# EAGLE design ALM_DEV2_i2 (EAGLE 5.07)

## Sheet 1 of 6
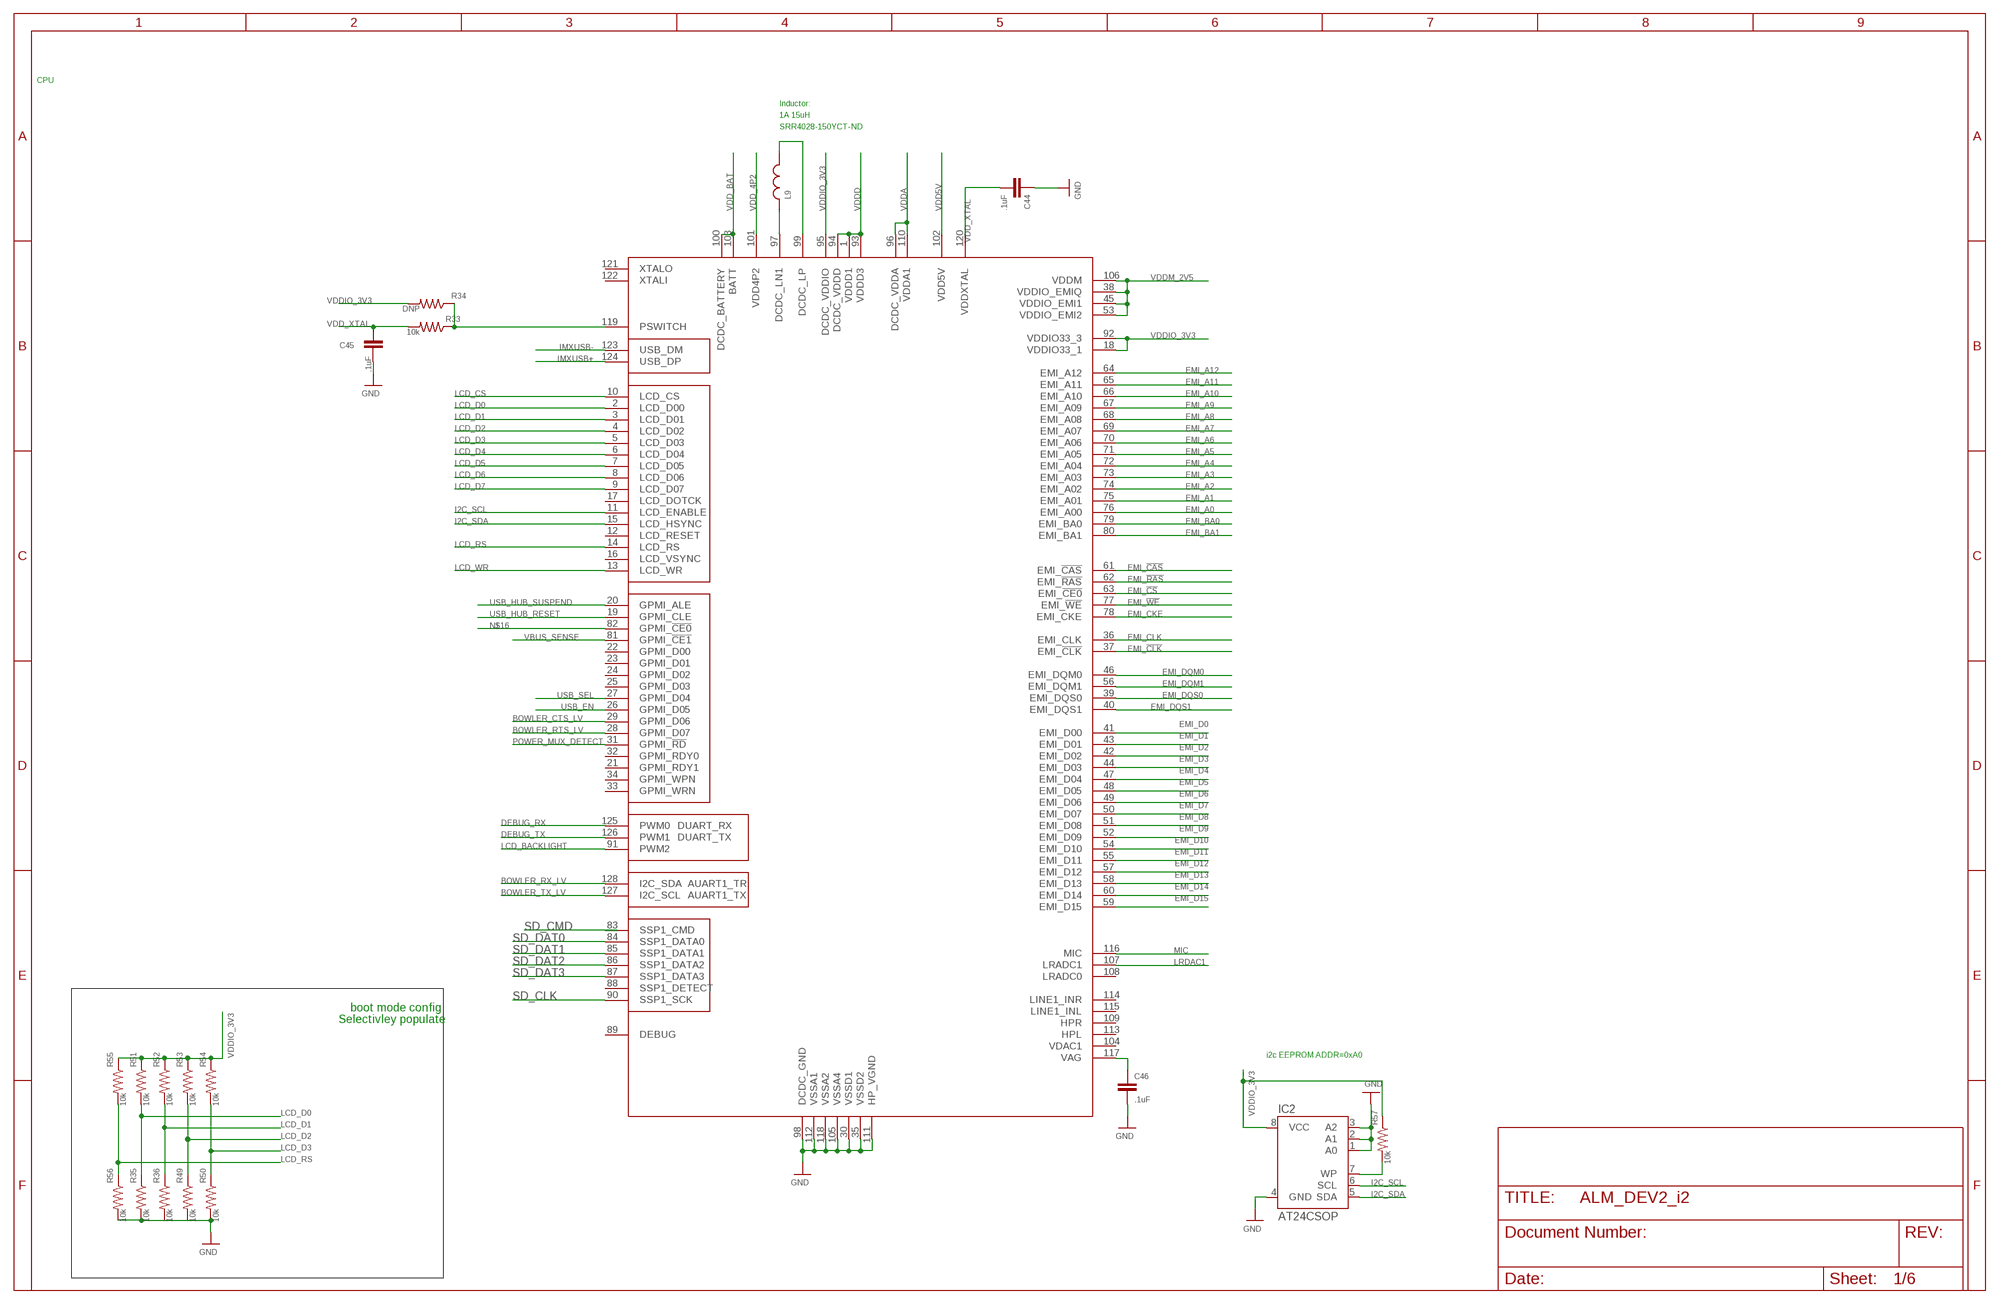
[diagram p0: schematic, sheet 1]

### Parts
C44  .1uF  C-EUC0402  [C0402]
C45  .1uF  C-EUC0402  [C0402]
C46  .1uF  C-EUC0402  [C0402]
IC2  AT24CSOP  [TSSOP8]
L9  INDUCTOR  [SRR4028]
R33  10k  R-US_R0603  [R0603]
R34  DNP  R-US_R0603  [R0603]
R35  10k  R-US_R0603  [R0603]
R36  10k  R-US_R0603  [R0603]
R49  10k  R-US_R0603  [R0603]
R50  10k  R-US_R0603  [R0603]
R51  10k  R-US_R0603  [R0603]
R52  10k  R-US_R0603  [R0603]
R53  10k  R-US_R0603  [R0603]
R54  10k  R-US_R0603  [R0603]
R55  10k  R-US_R0603  [R0603]
R56  10k  R-US_R0603  [R0603]
R57  10k  R-US_R0603  [R0603]
U$13  IMX233TQFP  [14MM_128TQFP_E0.40]

### Nets
BOWLER_CTS_LV: U$13.29(GPMI_D06) ; also sheet 5
BOWLER_RTS_LV: U$13.28(GPMI_D07) ; also sheet 5
BOWLER_RX_LV: U$13.128(I2C_SDA) ; also sheet 5
BOWLER_TX_LV: U$13.127(I2C_SCL) ; also sheet 5
DCDC_LIN1: L9.1 U$13.97(DCDC_LN1)
DCDC_LP1: L9.2 U$13.99(DCDC_LP)
DEBUG_RX: U$13.125(PWM0)
DEBUG_TX: U$13.126(PWM1)
EMI_!CAS: U$13.61(EMI_!CAS) ; also sheet 4
EMI_!CLK: U$13.37(EMI_!CLK) ; also sheet 4
EMI_!CS: U$13.63(EMI_!CE0) ; also sheet 4
EMI_!RAS: U$13.62(EMI_!RAS) ; also sheet 4
EMI_!WE: U$13.77(EMI_!WE) ; also sheet 4
EMI_A0: U$13.76(EMI_A00) ; also sheet 4
EMI_A1: U$13.75(EMI_A01) ; also sheet 4
EMI_A2: U$13.74(EMI_A02) ; also sheet 4
EMI_A3: U$13.73(EMI_A03) ; also sheet 4
EMI_A4: U$13.72(EMI_A04) ; also sheet 4
EMI_A5: U$13.71(EMI_A05) ; also sheet 4
EMI_A6: U$13.70(EMI_A06) ; also sheet 4
EMI_A7: U$13.69(EMI_A07) ; also sheet 4
EMI_A8: U$13.68(EMI_A08) ; also sheet 4
EMI_A9: U$13.67(EMI_A09) ; also sheet 4
EMI_A10: U$13.66(EMI_A10) ; also sheet 4
EMI_A11: U$13.65(EMI_A11) ; also sheet 4
EMI_A12: U$13.64(EMI_A12) ; also sheet 4
EMI_BA0: U$13.79(EMI_BA0) ; also sheet 4
EMI_BA1: U$13.80(EMI_BA1) ; also sheet 4
EMI_CKE: U$13.78(EMI_CKE) ; also sheet 4
EMI_CLK: U$13.36(EMI_CLK) ; also sheet 4
EMI_D0: U$13.41(EMI_D00) ; also sheet 4
EMI_D1: U$13.43(EMI_D01) ; also sheet 4
EMI_D2: U$13.42(EMI_D02) ; also sheet 4
EMI_D3: U$13.44(EMI_D03) ; also sheet 4
EMI_D4: U$13.47(EMI_D04) ; also sheet 4
EMI_D5: U$13.48(EMI_D05) ; also sheet 4
EMI_D6: U$13.49(EMI_D06) ; also sheet 4
EMI_D7: U$13.50(EMI_D07) ; also sheet 4
EMI_D8: U$13.51(EMI_D08) ; also sheet 4
EMI_D9: U$13.52(EMI_D09) ; also sheet 4
EMI_D10: U$13.54(EMI_D10) ; also sheet 4
EMI_D11: U$13.55(EMI_D11) ; also sheet 4
EMI_D12: U$13.57(EMI_D12) ; also sheet 4
EMI_D13: U$13.58(EMI_D13) ; also sheet 4
EMI_D14: U$13.60(EMI_D14) ; also sheet 4
EMI_D15: U$13.59(EMI_D15) ; also sheet 4
EMI_DQM0: U$13.46(EMI_DQM0) ; also sheet 4
EMI_DQM1: U$13.56(EMI_DQM1) ; also sheet 4
EMI_DQS0: U$13.39(EMI_DQS0) ; also sheet 4
EMI_DQS1: U$13.40(EMI_DQS1) ; also sheet 4
GND: C44.1 C45.2 C46.2 IC2.1(A0) IC2.2(A1) IC2.3(A2) IC2.4(GND) R35.2 R50.2 R56.2 U$13.30(VSSD1) U$13.35(VSSD2) U$13.98(DCDC_GND) U$13.105(VSSA4) U$13.111(HP_VGND) U$13.112(VSSA1) U$13.118(VSSA2) ; also sheet 2,3,4,5
I2C_SCL: IC2.6(SCL) U$13.11(LCD_ENABLE)
I2C_SDA: IC2.5(SDA) U$13.15(LCD_HSYNC)
IMXUSB+: U$13.124(USB_DP) ; also sheet 2
IMXUSB-: U$13.123(USB_DM) ; also sheet 2
LCD_BACKLIGHT: U$13.91(PWM2) ; also sheet 5
LCD_CS: U$13.10(LCD_CS) ; also sheet 5
LCD_D0: R35.1 R51.2 U$13.2(LCD_D00) ; also sheet 5
LCD_D1: R36.1 R52.2 U$13.3(LCD_D01) ; also sheet 5
LCD_D2: R49.1 R53.2 U$13.4(LCD_D02) ; also sheet 5
LCD_D3: R50.1 R54.2 U$13.5(LCD_D03) ; also sheet 5
LCD_D4: U$13.6(LCD_D04) ; also sheet 5
LCD_D5: U$13.7(LCD_D05) ; also sheet 5
LCD_D6: U$13.8(LCD_D06) ; also sheet 5
LCD_D7: U$13.9(LCD_D07) ; also sheet 5
LCD_RS: R55.2 R56.1 U$13.14(LCD_RS) ; also sheet 5
LCD_WR: U$13.13(LCD_WR) ; also sheet 5
LRDAC1: U$13.107(LRADC1) ; also sheet 5
MIC: U$13.116(MIC) ; also sheet 5
N$16: U$13.82(GPMI_!CE0)
N$26: R33.1 R34.1 U$13.119(PSWITCH)
N$27: IC2.7(WP) R57.2
N$28: C46.1 U$13.117(VAG)
POWER_MUX_DETECT: U$13.31(GPMI_!RD)
USB_EN: U$13.26(GPMI_D05) ; also sheet 2
USB_HUB_RESET: U$13.19(GPMI_CLE) ; also sheet 2
USB_HUB_SUSPEND: U$13.20(GPMI_ALE) ; also sheet 2
USB_SEL: U$13.27(GPMI_D04) ; also sheet 2
VBUS_SENSE: U$13.81(GPMI_!CE1) ; also sheet 2
VDD5V: U$13.102(VDD5V) ; also sheet 3
VDD_4P2: U$13.101(VDD4P2) ; also sheet 3
VDD_BAT: U$13.100(DCDC_BATTERY) U$13.103(BATT)
VDD_XTAL: C44.2 C45.1 R33.2 U$13.120(VDDXTAL)
VDDA: U$13.96(DCDC_VDDA) U$13.110(VDDA1) ; also sheet 3
VDDD: U$13.1(VDDD1) U$13.93(VDDD3) U$13.94(DCDC_VDDD) ; also sheet 3
VDDIO_3V3: IC2.8(VCC) R34.2 R51.1 R52.1 R53.1 R54.1 R55.1 R57.1 U$13.18(VDDIO33_1) U$13.92(VDDIO33_3) U$13.95(DCDC_VDDIO) ; also sheet 2,3,5
VDDM_2V5: U$13.38(VDDIO_EMIQ) U$13.45(VDDIO_EMI1) U$13.53(VDDIO_EMI2) U$13.106(VDDM) ; also sheet 3,4
Unconnected: R36.2 R49.2 U$13.12(LCD_RESET) U$13.16(LCD_VSYNC) U$13.17(LCD_DOTCK) U$13.21(GPMI_RDY1) U$13.22(GPMI_D00) U$13.23(GPMI_D01) U$13.24(GPMI_D02) U$13.25(GPMI_D03) U$13.32(GPMI_RDY0) U$13.33(GPMI_WRN) U$13.34(GPMI_WPN) U$13.83(SSP1_CMD) U$13.84(SSP1_DATA0) U$13.85(SSP1_DATA1) U$13.86(SSP1_DATA2) U$13.87(SSP1_DATA3) U$13.88(SSP1_DETECT) U$13.89(DEBUG) U$13.90(SSP1_SCK) U$13.104(VDAC1) U$13.108(LRADC0) U$13.109(HPR) U$13.113(HPL) U$13.114(LINE1_INR) U$13.115(LINE1_INL) U$13.121(XTALO) U$13.122(XTALI)

### Notes on the sheet
- CPU
- Inductor:
- 1A 15uH
- SRR4028-150YCT-ND
- boot mode config
- Selectivley populate
- i2c EEPROM ADDR=0xA0

## Sheet 2 of 6
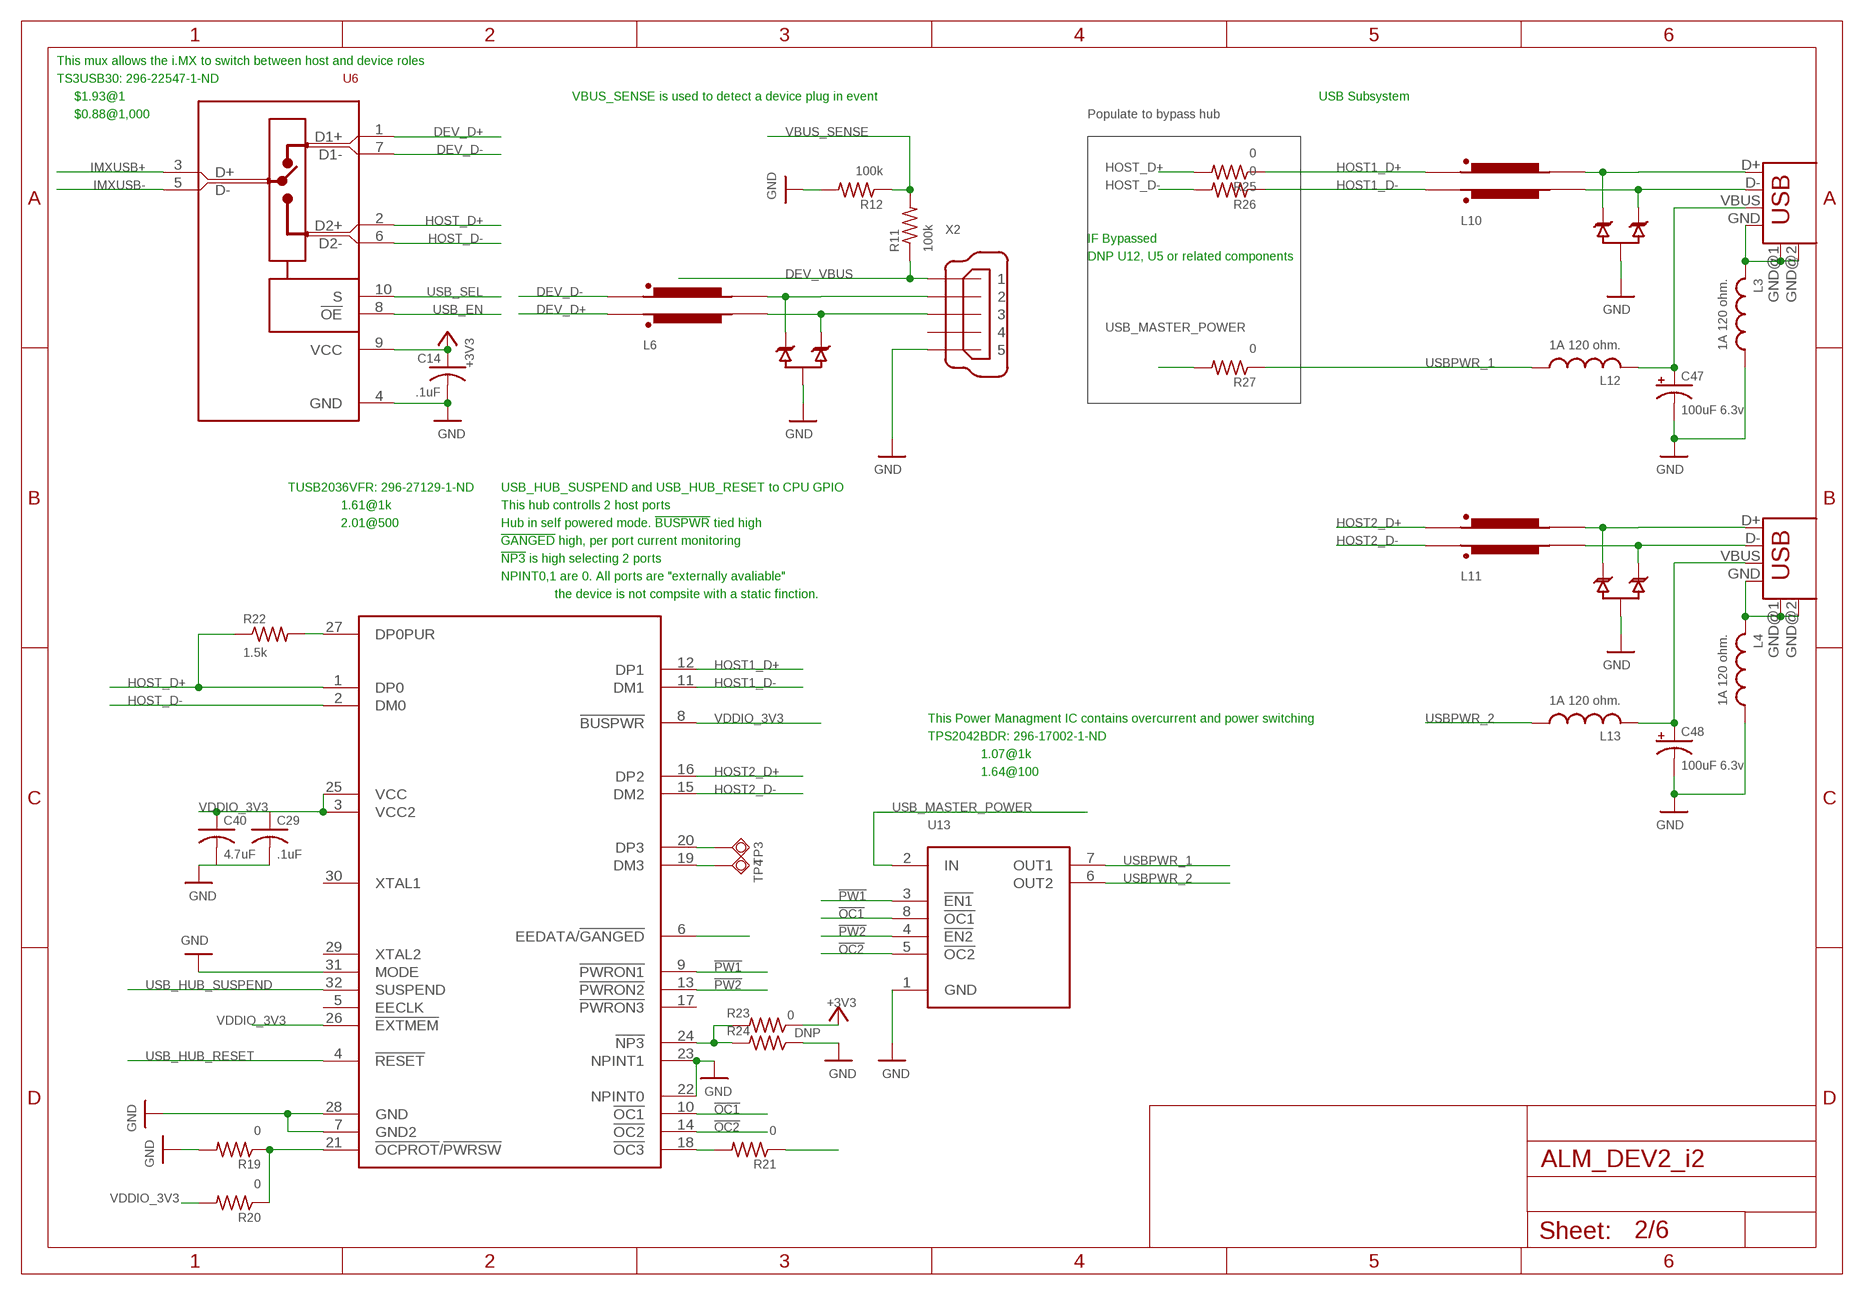
[diagram p1: schematic, sheet 2]

### Parts
C14  .1uF  C-USC0603  [C0603]
C29  .1uF  C-USC0603  [C0603]
C40  4.7uF  C-USC0603  [C0603]
C47  100uF 6.3v  CPOL-USE1.8-4  [E1,8-4]
C48  100uF 6.3v  CPOL-USE1.8-4  [E1,8-4]
L3  1A 120 ohm.  L-USL2825P  [L2825P]
L4  1A 120 ohm.  L-USL2825P  [L2825P]
L6  FERITE_S0805  [SPLIT_0805]
L10  FERITE_S0805  [SPLIT_0805]
L11  FERITE_S0805  [SPLIT_0805]
L12  1A 120 ohm.  L-USL2825P  [L2825P]
L13  1A 120 ohm.  L-USL2825P  [L2825P]
R11  100k  R-US_R0603  [R0603]
R12  100k  R-US_R0603  [R0603]
R19  0  R-US_R0603  [R0603]
R20  0  R-US_R0603  [R0603]
R21  0  R-US_R0603  [R0603]
R22  1.5k  R-US_R0603  [R0603]
R23  0  R-US_R0603  [R0603]
R24  DNP  R-US_R0603  [R0603]
R25  0  R-US_R0603  [R0603]
R26  0  R-US_R0603  [R0603]
R27  0  R-US_R0603  [R0603]
TP3  TPSQB1,27  [B1,27]
TP4  TPSQB1,27  [B1,27]
U6  TS3USB30E  [TQFP10]
U7  RCLAMP0502B  [SOT-523]
U8  RCLAMP0502B  [SOT-523]
U9  RCLAMP0502B  [SOT-523]
U10  TUSB2036  [S-PQFP-G32]
U13  TPS2042BDR  [SO08]
USB3  USB-A-H  [USB-A-H]
USB4  USB-A-H  [USB-A-H]
X2  MINI-USB-SHIELD-UX60-MB-5S8  [UX60-MB-5S8]

### Nets
!OC1: U10.10(!OC1) U13.8(!OC1)
!OC2: U10.14(!OC2) U13.5(!OC2)
!PW1: U10.9(!PWRON1) U13.3(!EN1)
!PW2: U10.13(!PWRON2) U13.4(!EN2)
+3V3: C14.1 R23.1 U6.9(VCC) ; also sheet 5
DEV_D+: L6.4 U6.1(D1+)
DEV_D+_UNFILTERED1: X2.3
DEV_D-: L6.1 U6.7(D1-)
DEV_D-_UNFILTERED1: L6.2 U7.2
DEV_VBUS: R11.1 X2.1 ; also sheet 3
GND: C14.2 C29.2 C47.- C48.- L3.1 L4.1 R12.2 R19.2 R24.1 U6.4(GND) U7.3 U8.3 U9.3 U10.7(GND2) U10.22(NPINT0) U10.23(NPINT1) U10.28(GND) U10.31(MODE) U13.1(GND) X2.5 ; also sheet 1,3,4,5
HOST1_D+: L10.1 R25.1
HOST1_D+_UNFILTERED1: L10.2 U8.2 USB3.D+
HOST1_D-: L10.4 R26.1
HOST1_D-_UNFILTERED1: L10.3 U8.1 USB3.D-
HOST2_D+: L11.1
HOST2_D+_UNFILTERED1: USB4.D+
HOST2_D-: L11.4
HOST2_D-_UNFILTERED1: L11.3 U9.1 USB4.D-
HOST_D+: R22.1 R25.2 U6.2(D2+) U10.1(DP0)
HOST_D-: R26.2 U6.6(D2-) U10.2(DM0)
IMXUSB+: U6.3(D+) ; also sheet 1
IMXUSB-: U6.5(D-) ; also sheet 1
N$13: L6.3 U7.1
N$17: X2.2
N$18: L11.2 U9.2
N$30: R19.1 R20.1 U10.21(!OCPROT!/!PWRSW)
N$31: R21.2 U10.18(!OC3)
N$32: TP3.TP U10.20(DP3)
N$33: TP4.TP U10.19(DM3)
N$34: R22.2 U10.27(DP0PUR)
N$35: R23.2 R24.2 U10.24(!NP3)
N$36: C47.+ L12.2 USB3.VBUS
N$37: C48.+ L13.2 USB4.VBUS
N$38: R21.1
N$39: L3.2 USB3.GND USB3.GND@1(GND) USB3.GND@2(GND)
N$40: L4.2 USB4.GND USB4.GND@1(GND) USB4.GND@2(GND)
USB_EN: U6.8(!OE) ; also sheet 1
USB_HUB_RESET: U10.4(!RESET) ; also sheet 1
USB_HUB_SUSPEND: U10.32(SUSPEND) ; also sheet 1
USB_MASTER_POWER: R27.2 U13.2(IN)
USB_SEL: U6.10(S) ; also sheet 1
USBPWR_1: L12.1 R27.1 U13.7(OUT1)
USBPWR_2: L13.1 U13.6(OUT2)
VBUS_SENSE: R11.2 R12.1 ; also sheet 1
VDDIO_3V3: C40.1 R20.2 U10.3(VCC2) U10.6(EEDATA/!GANGED) U10.8(!BUSPWR) U10.25(VCC) U10.26(!EXTMEM) ; also sheet 1,3,5
Unconnected: C29.1 C40.2 U10.5(EECLK) U10.11(DM1) U10.12(DP1) U10.15(DM2) U10.16(DP2) U10.17(!PWRON3) U10.29(XTAL2) U10.30(XTAL1) X2.4 X2.M1(S1) X2.M2(S2) X2.M3(S3) X2.M4(S4)

### Notes on the sheet
- This mux allows the i.MX to switch between host and device roles
- TS3USB30: 296-22547-1-ND
- $1.93@1 | VBUS_SENSE is used to detect a device plug in event | USB Subsystem
- $0.88@1,000 | Populate to bypass hub
- IF Bypassed
- DNP U12, U5 or related components
- TUSB2036VFR: 296-27129-1-ND | USB_HUB_SUSPEND and USB_HUB_RESET to CPU GPIO
- 1.61@1k | This hub controlls 2 host ports
- 2.01@500 | Hub in self powered mode. !BUSPWR! tied high
- !GANGED! high, per port current monitoring
- !NP3! is high selecting 2 ports
- NPINT0,1 are 0. All ports are "externally avaliable"
- the device is not compsite with a static finction.
- This Power Managment IC contains overcurrent and power switching
- TPS2042BDR: 296-17002-1-ND
- 1.07@1k
- 1.64@100

## Sheet 3 of 6
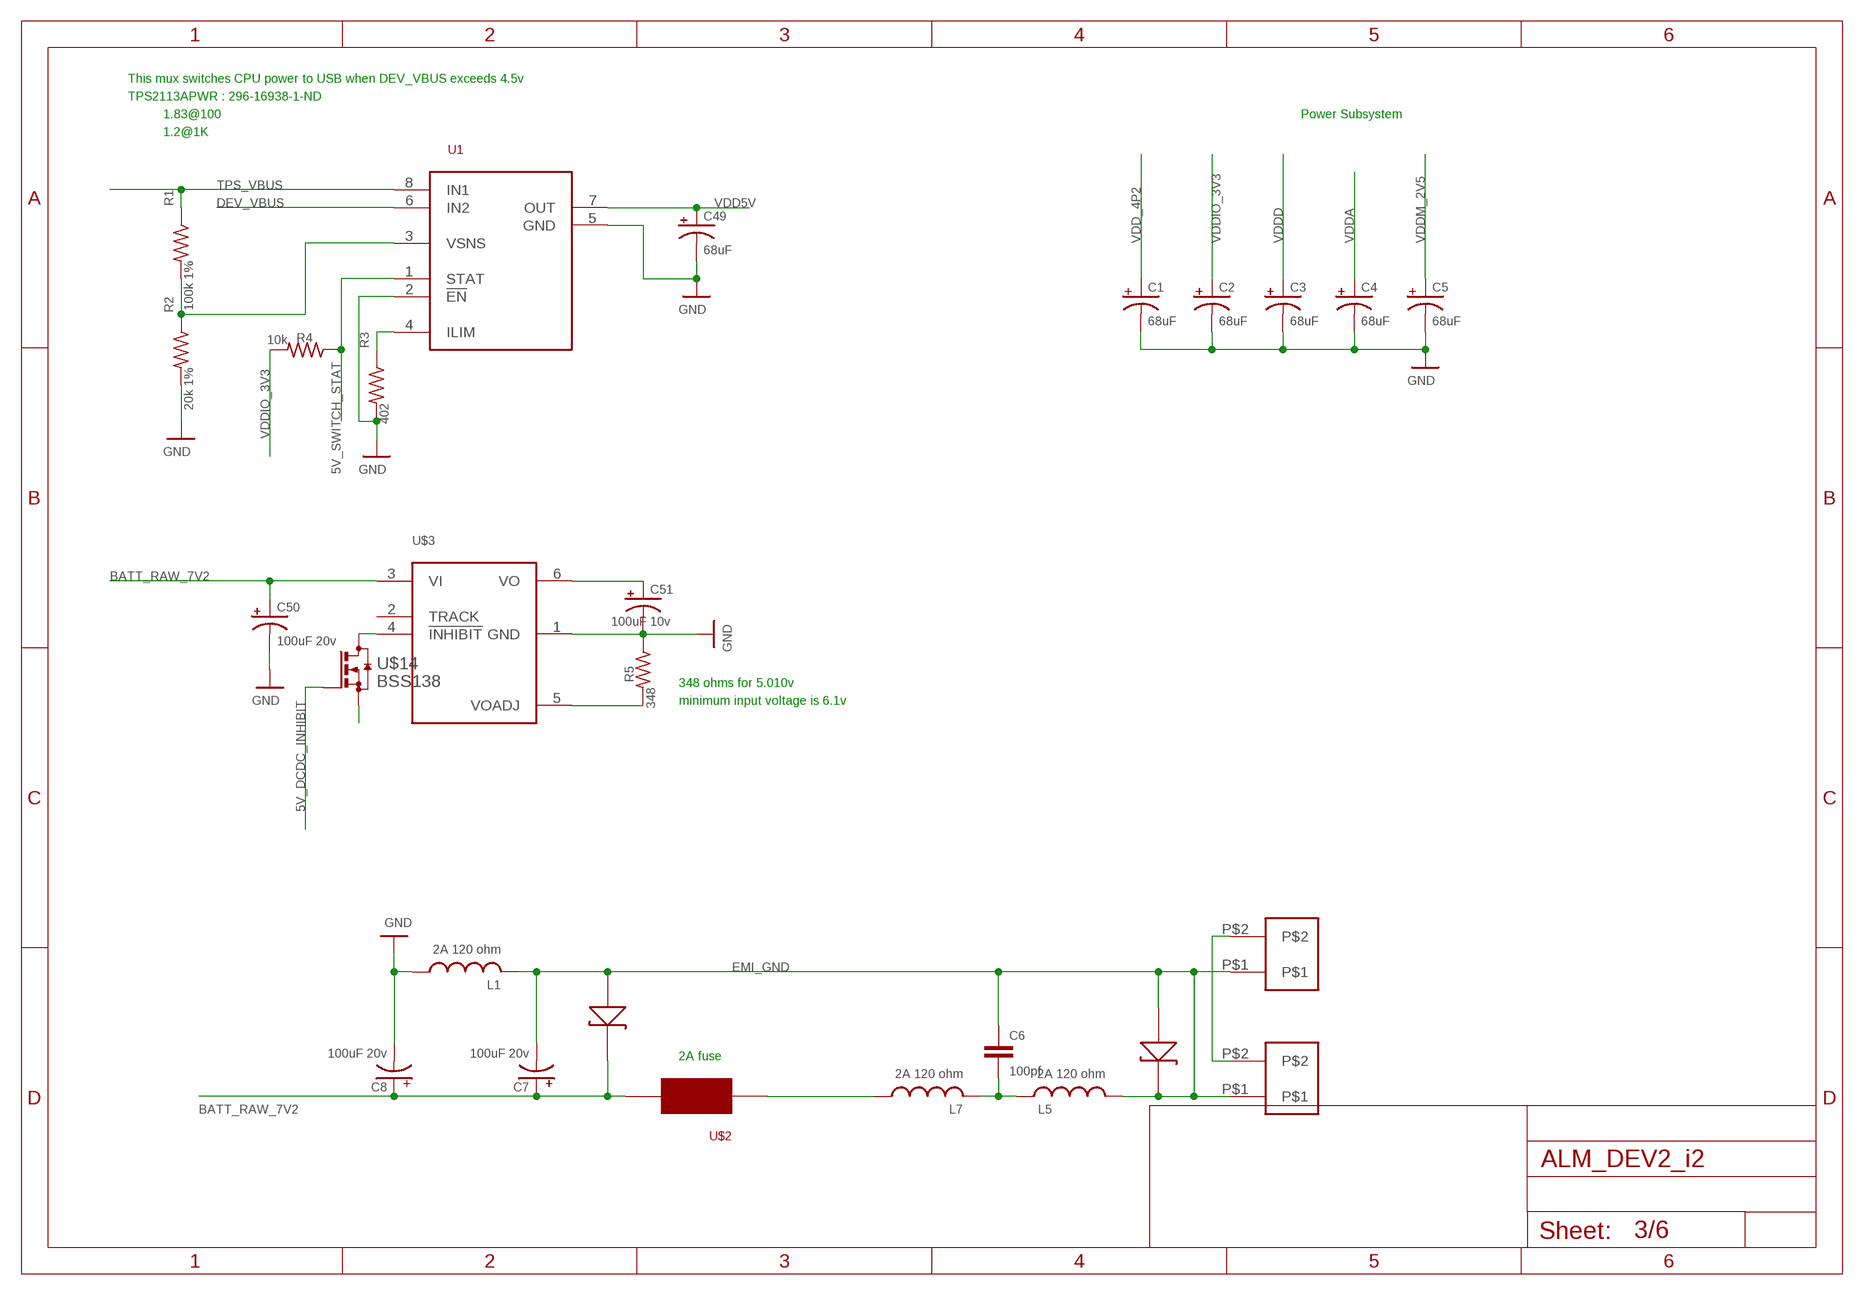
[diagram p2: schematic, sheet 3]

### Parts
C1  68uF  CPOL-US085CS-1AR  [085CS_1AR]
C2  68uF  CPOL-US085CS-1AR  [085CS_1AR]
C3  68uF  CPOL-US085CS-1AR  [085CS_1AR]
C4  68uF  CPOL-US085CS-1AR  [085CS_1AR]
C5  68uF  CPOL-US085CS-1AR  [085CS_1AR]
C6  100pf  C-EUC0603  [C0603]
C7  100uF 20v  CPOL-US085CS-1AR  [085CS_1AR]
C8  100uF 20v  CPOL-US085CS-1AR  [085CS_1AR]
C49  68uF  CPOL-US085CS-1AR  [085CS_1AR]
C50  100uF 20v  CPOL-US085CS-1AR  [085CS_1AR]
C51  100uF 10v  CPOL-US085CS-1AR  [085CS_1AR]
L1  2A 120 ohm  L-USL2825P  [L2825P]
L5  2A 120 ohm  L-USL2825P  [L2825P]
L7  2A 120 ohm  L-USL2825P  [L2825P]
R1  100k 1%  R-US_R0603  [R0603]
R2  20k 1%  R-US_R0603  [R0603]
R3  402  R-US_R0603  [R0603]
R4  10k  R-US_R0603  [R0603]
R5  348  R-US_R0603  [R0603]
U1  TPS2113A  [TSSOP8]
U$2  0154  [0154]
U$3  PTH08000W  [PTH08000W]
U$11  SK152  [DO-214AB]
U$12  2P  [2PTH]
U$14  BSS138  [SOT23]
U$15  2P  [2PTH]
U$16  SK152  [DO-214AB]

### Nets
5V_DCDC_INHIBIT: U$14.1(G)
5V_SWITCH_STAT: R4.1 U1.1(STAT)
BATT_RAW_7V2: C7.+ C8.+ C50.+ U$2.2 U$3.3(VI) U$11.CAT
DEV_VBUS: U1.6(IN2) ; also sheet 2
EMI_GND: C7.- L1.2 L5.2 U$11.AN U$12.P$1 U$15.P$1 U$16.AN U$16.CAT
GND: C1.- C2.- C3.- C4.- C5.- C8.- C49.- C50.- C51.- L1.1 R2.2 R3.2 R5.1 U1.2(!EN) U1.5(GND) U$3.1(GND) ; also sheet 1,2,4,5
N$1: R1.2 R2.1 U1.3(VSNS)
N$2: R3.1 U1.4(ILIM)
N$3: C51.+ U$3.6(VO)
N$4: R5.2 U$3.5(VOADJ)
N$5: U$3.4(!INHIBIT) U$14.3(D)
N$6: U$14.2(S)
N$7: U$12.P$2 U$15.P$2
N$41: L7.1 U$2.1
N$43: L5.1 L7.2
TPS_VBUS: R1.1 U1.8(IN1)
VDD5V: C49.+ U1.7(OUT) ; also sheet 1
VDD_4P2: C1.+ ; also sheet 1
VDDA: C4.+ ; also sheet 1
VDDD: C3.+ ; also sheet 1
VDDIO_3V3: C2.+ R4.2 ; also sheet 1,2,5
Unconnected: C5.+ C6.1 C6.2 U$3.2(TRACK)

### Notes on the sheet
- This mux switches CPU power to USB when DEV_VBUS exceeds 4.5v
- TPS2113APWR : 296-16938-1-ND
- 1.83@100 | Power Subsystem
- 1.2@1K
- 348 ohms for 5.010v
- minimum input voltage is 6.1v
- 2A fuse

## Sheet 4 of 6
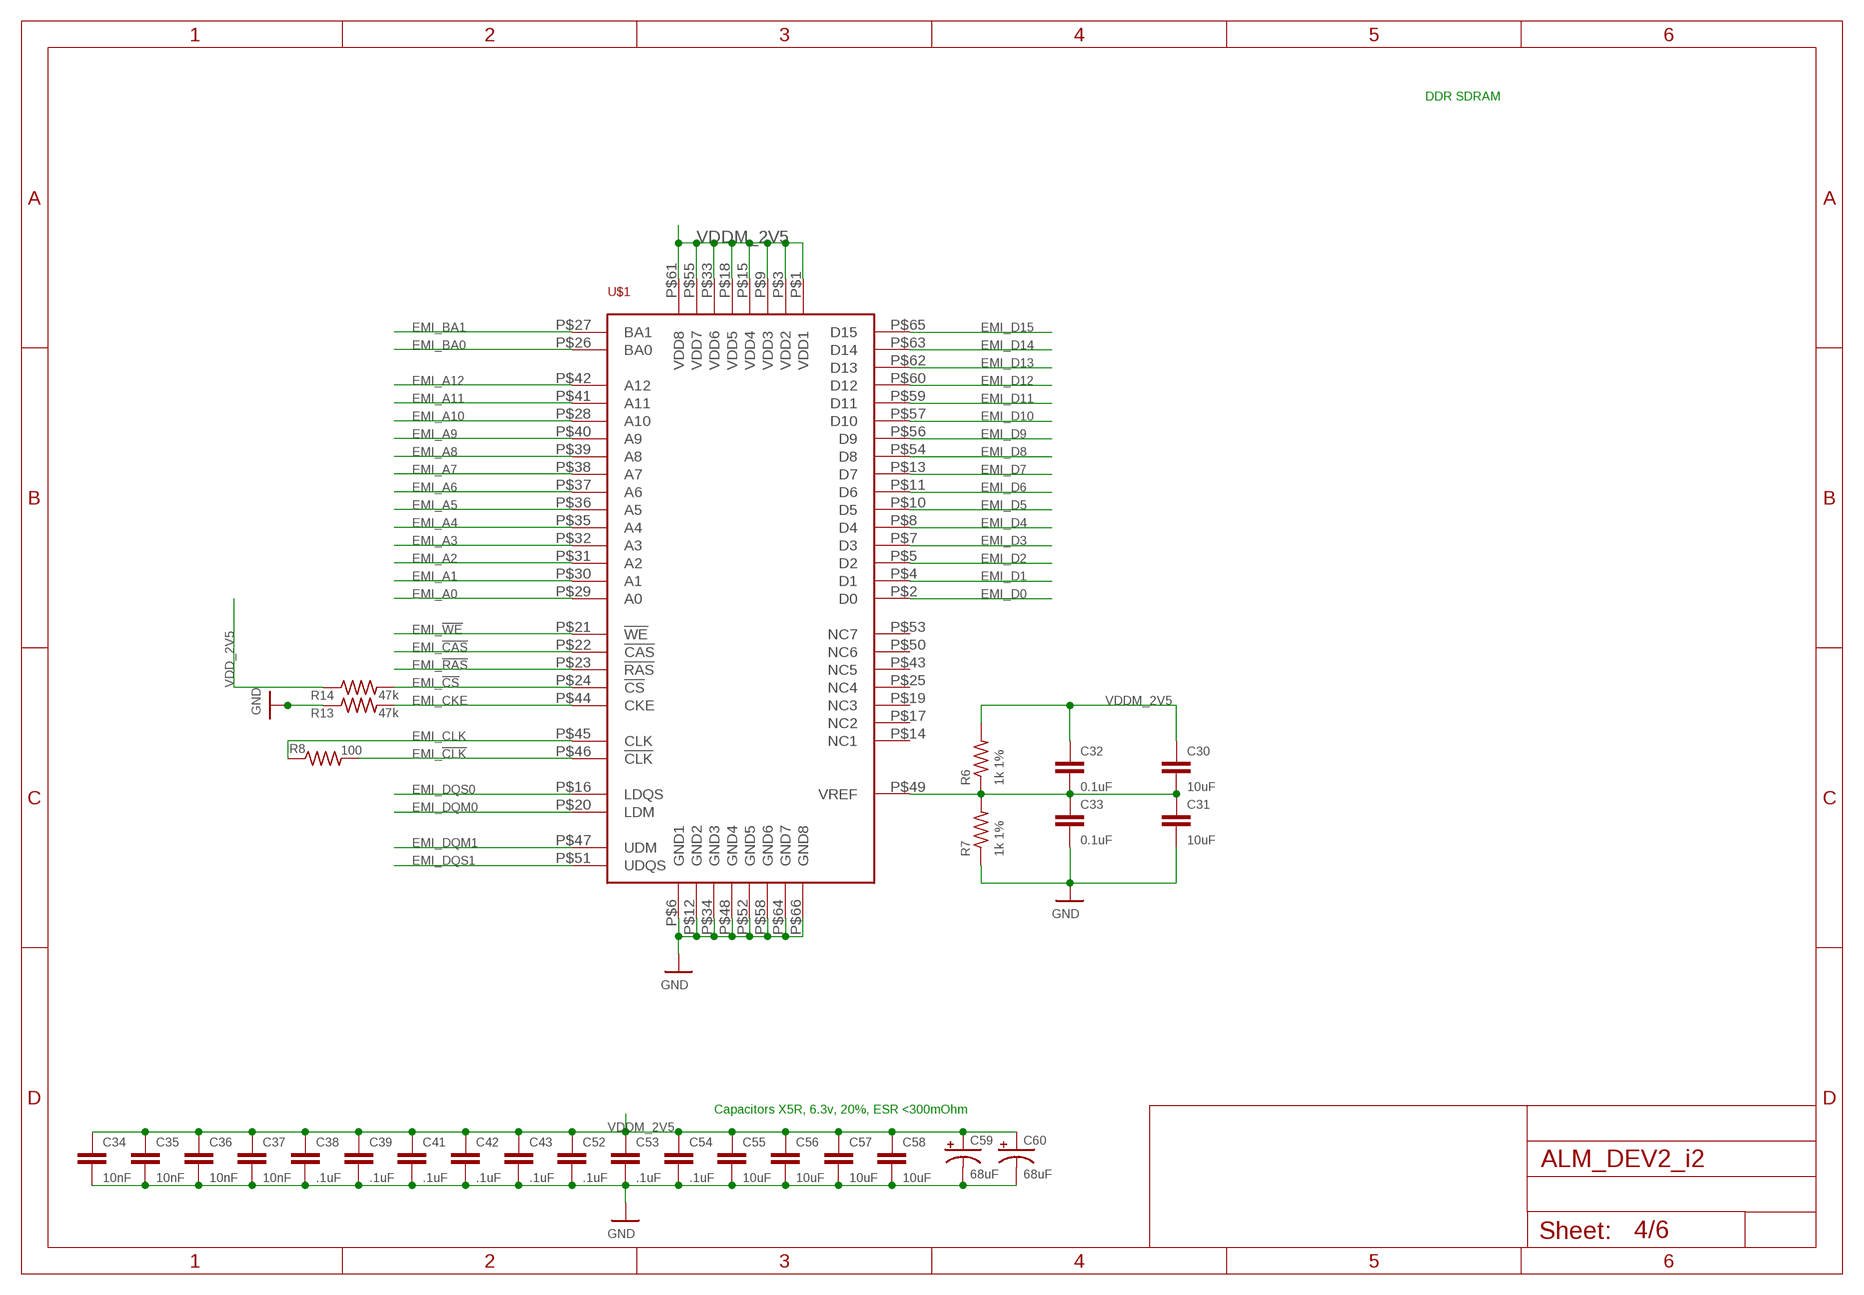
[diagram p3: schematic, sheet 4]

### Parts
C30  10uF  C-EUC0603  [C0603]
C31  10uF  C-EUC0603  [C0603]
C32  0.1uF  C-EUC0402  [C0402]
C33  0.1uF  C-EUC0402  [C0402]
C34  10nF  C-EUC0402  [C0402]
C35  10nF  C-EUC0402  [C0402]
C36  10nF  C-EUC0603  [C0603]
C37  10nF  C-EUC0402  [C0402]
C38  .1uF  C-EUC0402  [C0402]
C39  .1uF  C-EUC0402  [C0402]
C41  .1uF  C-EUC0402  [C0402]
C42  .1uF  C-EUC0402  [C0402]
C43  .1uF  C-EUC0402  [C0402]
C52  .1uF  C-EUC0402  [C0402]
C53  .1uF  C-EUC0402  [C0402]
C54  .1uF  C-EUC0402  [C0402]
C55  10uF  C-EUC0402  [C0402]
C56  10uF  C-EUC0402  [C0402]
C57  10uF  C-EUC0402  [C0402]
C58  10uF  C-EUC0402  [C0402]
C59  68uF  CPOL-USR/2012-12R  [R/2012-12R]
C60  68uF  CPOL-USR/2012-12R  [R/2012-12R]
R6  1k 1%  R-US_R0402  [R0402]
R7  1k 1%  R-US_R0402  [R0402]
R8  100  R-US_R0402  [R0402]
R13  47k  R-US_R0402  [R0402]
R14  47k  R-US_R0402  [R0402]
U$1  DDR_SDRAM_X16  [66TSOP2]

### Nets
EMI_!CAS: U$1.P$22(!CAS) ; also sheet 1
EMI_!CLK: R8.2 U$1.P$46(!CLK) ; also sheet 1
EMI_!CS: R14.2 U$1.P$24(!CS) ; also sheet 1
EMI_!RAS: U$1.P$23(!RAS) ; also sheet 1
EMI_!WE: U$1.P$21(!WE) ; also sheet 1
EMI_A0: U$1.P$29(A0) ; also sheet 1
EMI_A1: U$1.P$30(A1) ; also sheet 1
EMI_A2: U$1.P$31(A2) ; also sheet 1
EMI_A3: U$1.P$32(A3) ; also sheet 1
EMI_A4: U$1.P$35(A4) ; also sheet 1
EMI_A5: U$1.P$36(A5) ; also sheet 1
EMI_A6: U$1.P$37(A6) ; also sheet 1
EMI_A7: U$1.P$38(A7) ; also sheet 1
EMI_A8: U$1.P$39(A8) ; also sheet 1
EMI_A9: U$1.P$40(A9) ; also sheet 1
EMI_A10: U$1.P$28(A10) ; also sheet 1
EMI_A11: U$1.P$41(A11) ; also sheet 1
EMI_A12: U$1.P$42(A12) ; also sheet 1
EMI_BA0: U$1.P$26(BA0) ; also sheet 1
EMI_BA1: U$1.P$27(BA1) ; also sheet 1
EMI_CKE: R13.2 U$1.P$44(CKE) ; also sheet 1
EMI_CLK: R8.1 U$1.P$45(CLK) ; also sheet 1
EMI_D0: U$1.P$2(D0) ; also sheet 1
EMI_D1: U$1.P$4(D1) ; also sheet 1
EMI_D2: U$1.P$5(D2) ; also sheet 1
EMI_D3: U$1.P$7(D3) ; also sheet 1
EMI_D4: U$1.P$8(D4) ; also sheet 1
EMI_D5: U$1.P$10(D5) ; also sheet 1
EMI_D6: U$1.P$11(D6) ; also sheet 1
EMI_D7: U$1.P$13(D7) ; also sheet 1
EMI_D8: U$1.P$54(D8) ; also sheet 1
EMI_D9: U$1.P$56(D9) ; also sheet 1
EMI_D10: U$1.P$57(D10) ; also sheet 1
EMI_D11: U$1.P$59(D11) ; also sheet 1
EMI_D12: U$1.P$60(D12) ; also sheet 1
EMI_D13: U$1.P$62(D13) ; also sheet 1
EMI_D14: U$1.P$63(D14) ; also sheet 1
EMI_D15: U$1.P$65(D15) ; also sheet 1
EMI_DQM0: U$1.P$20(LDM) ; also sheet 1
EMI_DQM1: U$1.P$47(UDM) ; also sheet 1
EMI_DQS0: U$1.P$16(LDQS) ; also sheet 1
EMI_DQS1: U$1.P$51(UDQS) ; also sheet 1
GND: C31.2 C33.2 C34.2 C35.2 C36.2 C37.2 C38.2 C39.2 C41.2 C42.2 C43.2 C52.2 C53.2 C54.2 C55.2 C56.2 C57.2 C58.2 C59.- C60.- R7.1 R13.1 U$1.P$6(GND1) U$1.P$12(GND2) U$1.P$34(GND3) U$1.P$48(GND4) U$1.P$52(GND5) U$1.P$58(GND6) U$1.P$64(GND7) U$1.P$66(GND8) ; also sheet 1,2,3,5
N$8: C30.2 C31.1 C32.2 C33.1 R6.1 R7.2 U$1.P$49(VREF)
VDD_2V5: R14.1
VDDM_2V5: C30.1 C32.1 C34.1 C35.1 C36.1 C37.1 C38.1 C39.1 C41.1 C42.1 C43.1 C52.1 C53.1 C54.1 C55.1 C56.1 C57.1 C58.1 C59.+ C60.+ R6.2 U$1.P$1(VDD1) U$1.P$3(VDD2) U$1.P$9(VDD3) U$1.P$15(VDD4) U$1.P$18(VDD5) U$1.P$33(VDD6) U$1.P$55(VDD7) U$1.P$61(VDD8) ; also sheet 1,3
Unconnected: U$1.P$14(NC1) U$1.P$17(NC2) U$1.P$19(NC3) U$1.P$25(NC4) U$1.P$43(NC5) U$1.P$50(NC6) U$1.P$53(NC7)

### Notes on the sheet
- DDR SDRAM
- Capacitors X5R, 6.3v, 20%, ESR <300mOhm

## Sheet 5 of 6
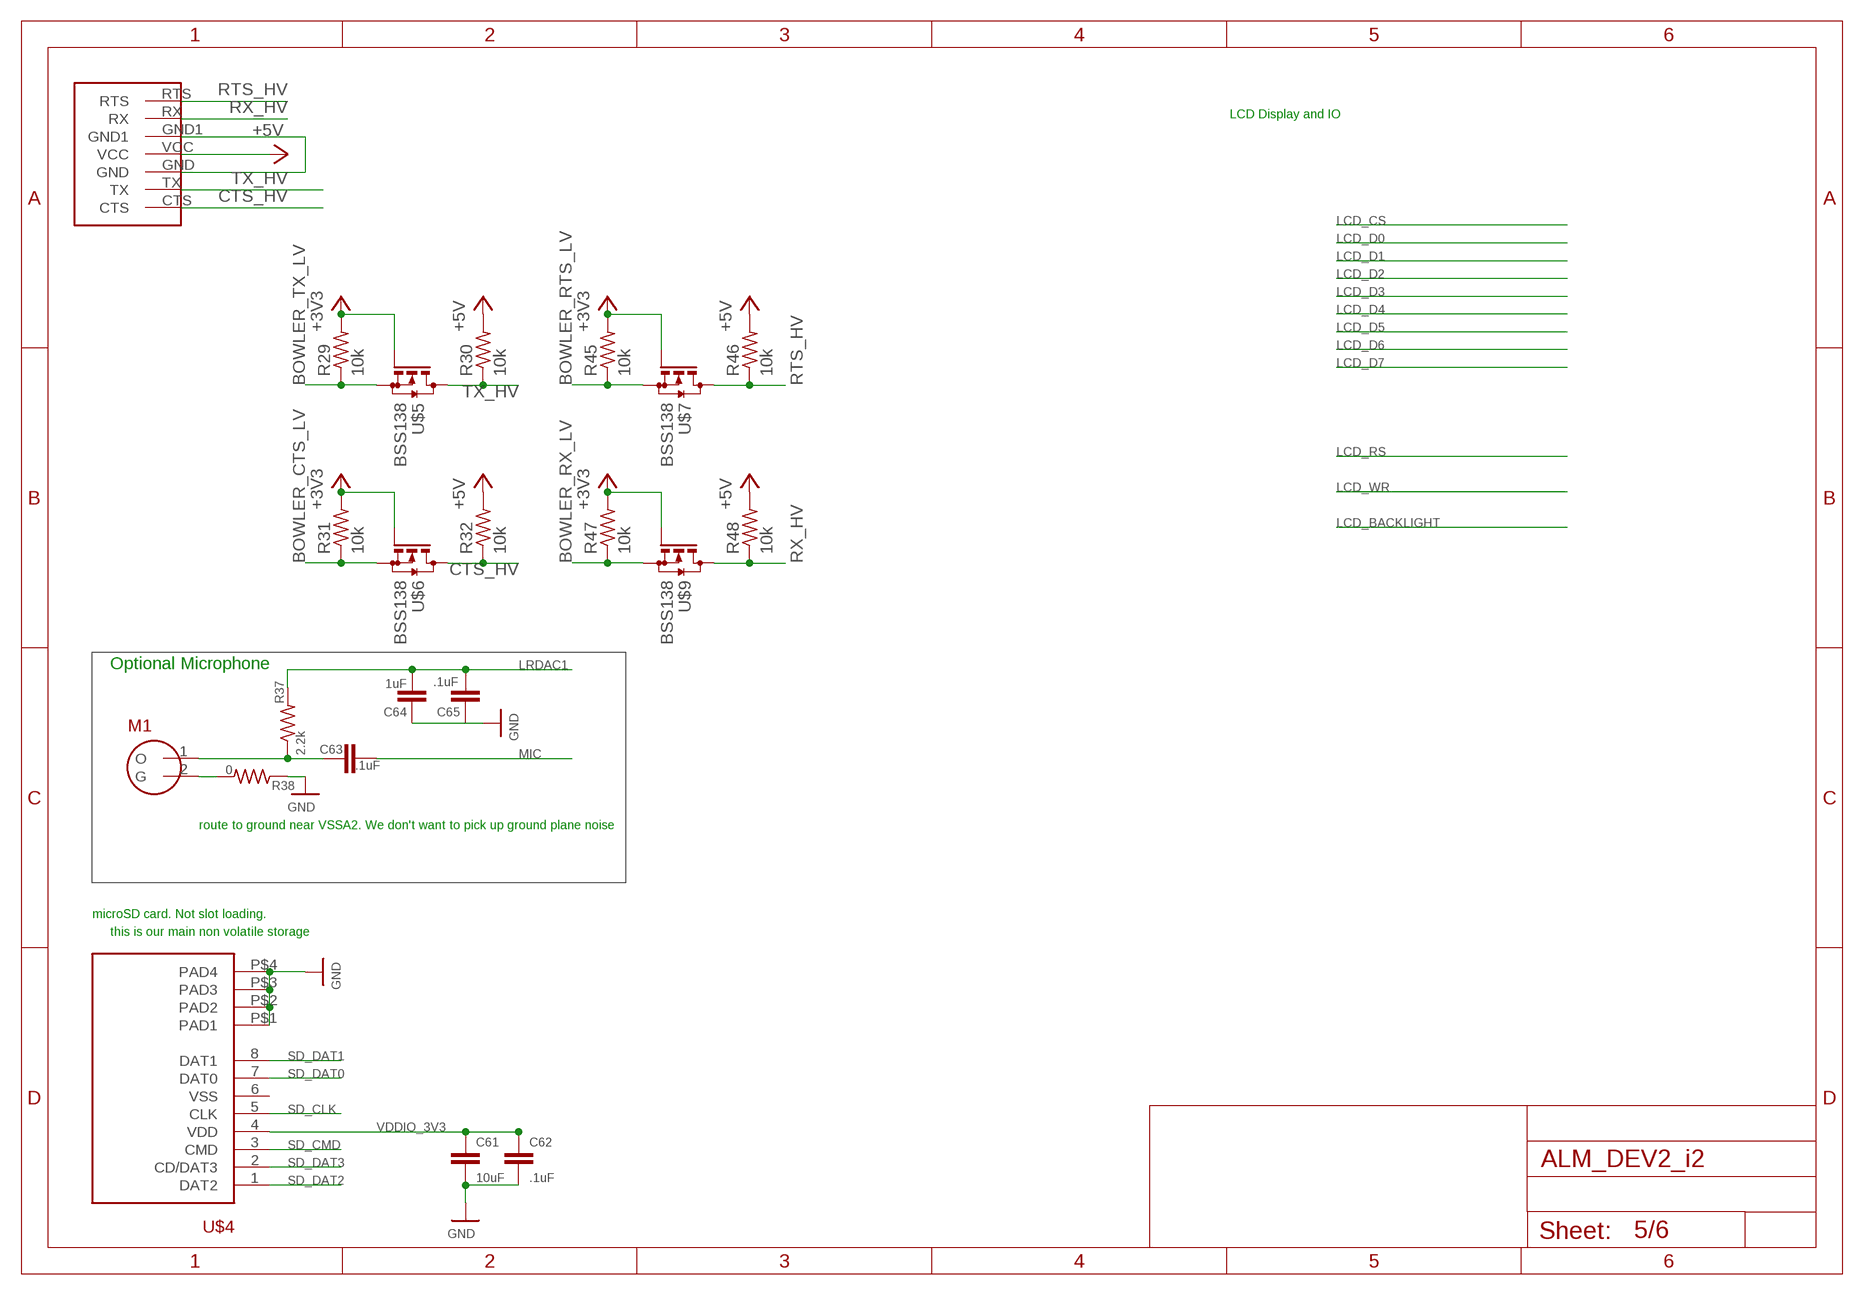
[diagram p4: schematic, sheet 5]

### Parts
C61  10uF  C-EUC0402  [C0402]
C62  .1uF  C-EUC0402  [C0402]
C63  .1uF  C-EUC0402  [C0402]
C64  1uF  C-EUC0402  [C0402]
C65  .1uF  C-EUC0402  [C0402]
M1  CMA-4544PF-W  [CMA-4544PF-W]
R29  10k  R-US_R0603  [R0603]
R30  10k  R-US_R0603  [R0603]
R31  10k  R-US_R0603  [R0603]
R32  10k  R-US_R0603  [R0603]
R37  2.2k  R-US_R0402  [R0402]
R38  0  R-US_R0402  [R0402]
R45  10k  R-US_R0603  [R0603]
R46  10k  R-US_R0603  [R0603]
R47  10k  R-US_R0603  [R0603]
R48  10k  R-US_R0603  [R0603]
U$4  101-00303  [AMPHENOL_USD]
U$5  BSS138  [SOT23]
U$6  BSS138  [SOT23]
U$7  BSS138  [SOT23]
U$9  BSS138  [SOT23]
U$10  WASP7PIN  [WASP7PIN]

### Nets
+3V3: R29.2 R31.2 R45.2 R47.2 U$5.1(G) U$6.1(G) U$7.1(G) U$9.1(G) ; also sheet 2
+5V: R30.2 R32.2 R46.2 R48.2 U$10.VCC
BOWLER_CTS_LV: R31.1 U$6.2(S) ; also sheet 1
BOWLER_RTS_LV: R45.1 U$7.2(S) ; also sheet 1
BOWLER_RX_LV: R47.1 U$9.2(S) ; also sheet 1
BOWLER_TX_LV: R29.1 U$5.2(S) ; also sheet 1
CTS_HV: R32.1 U$6.3(D) U$10.CTS
GND: C61.2 C62.2 C64.1 R38.1 U$4.P$1(PAD1) U$4.P$2(PAD2) U$4.P$3(PAD3) U$4.P$4(PAD4) U$10.GND U$10.GND1 ; also sheet 1,2,3,4
LRDAC1: C64.2 C65.2 R37.2 ; also sheet 1
MIC: C63.2 ; also sheet 1
N$9: M1.2(G) R38.2
N$14: C63.1 M1.1(O) R37.1
RTS_HV: R46.1 U$7.3(D) U$10.RTS
RX_HV: R48.1 U$9.3(D) U$10.RX
TX_HV: R30.1 U$5.3(D) U$10.TX
VDDIO_3V3: C61.1 C62.1 U$4.4(VDD) ; also sheet 1,2,3
Unconnected: C65.1 U$4.1(DAT2) U$4.2(CD/DAT3) U$4.3(CMD) U$4.5(CLK) U$4.6(VSS) U$4.7(DAT0) U$4.8(DAT1)

### Notes on the sheet
- LCD Display and IO
- Optional Microphone
- route to ground near VSSA2. We don't want to pick up ground plane noise
- microSD card. Not slot loading.
- this is our main non volatile storage

## Sheet 6 of 6
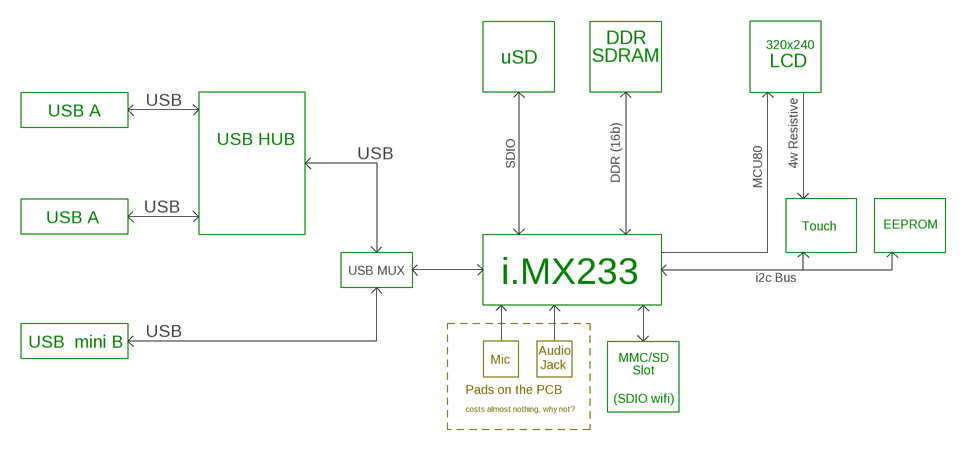
[diagram p5: schematic, sheet 6]

### Notes on the sheet
- DDR
- 320x240
- uSD | SDRAM | LCD
- USB
- USB A
- USB HUB
- USB
- SDIO | 4w Resistive
- DDR (16b)
- MCU80
- USB
- USB A
- Touch | EEPROM
- USB MUX
- i.MX233 | i2c Bus
- USB
- USB  mini B
- Audio
- Mic | MMC/SD
- Jack
- Slot
- Pads on the PCB
- (SDIO wifi)
- costs almost nothing, why not?

## Library data of the parts
C1-C5 C7 C8 C49-C51 C59 C60 = resistor:CPOL-US: POLARIZED CAPACITOR, American symbol
C6 C30-C39 C41-C46 C52-C58 C61-C65 = rcl:C-EU: CAPACITOR, European symbol
C14 C29 C40 = rcl:C-US: CAPACITOR, American symbol
C47 C48 = rcl:CPOL-US: POLARIZED CAPACITOR, American symbol
IC2 = at24cxx:AT24C*: 2-wire serial EEPROM
L1 L3-L5 L7 L12 L13 = rcl:L-US: INDUCTOR, American symbol
L6 L10 L11 = ferrite_split_0805:FERITE_S0805
L9 = Inductor_SRR4028:INDUCTOR
M1 = CMA-4544PF-W:CMA-4544PF-W
R1-R8 R11-R14 R19-R27 R29-R38 R45-R57 = rcl:R-US_: RESISTOR, American symbol
TP3 TP4 = testpad:TPSQ: Test pad
U1 = tps2113a:TPS2113A
U6 = TS3USB30:TS3USB30E
U7-U9 = rclamp0502b:RCLAMP0502B
U10 = tusb2036:TUSB2036
U13 = TPS2042BDR:TPS2042BDR
U$1 = DDR_SDRAM:DDR_SDRAM_X16
U$2 = SMT_Fuse_0154001:0154
U$3 = PTH0800W:PTH08000W
U$4 = amphenol_101-00303_usd:101-00303
U$5-U$7 U$9 U$14 = WASP:BSS138
U$10 = wasp7pin:WASP7PIN
U$11 U$16 = SK152:SK152
U$12 U$15 = con_2h_70555-0001:2P
U$13 = imx233:IMX233TQFP
USB3 USB4 = con-usb-2:USB: USB Connectors
X2 = con-hirose:MINI-USB-SHIELD-: MINI USB Connector Source: http://www.hirose.co.jp/cataloge_hp/e24000019.pdf

## Board
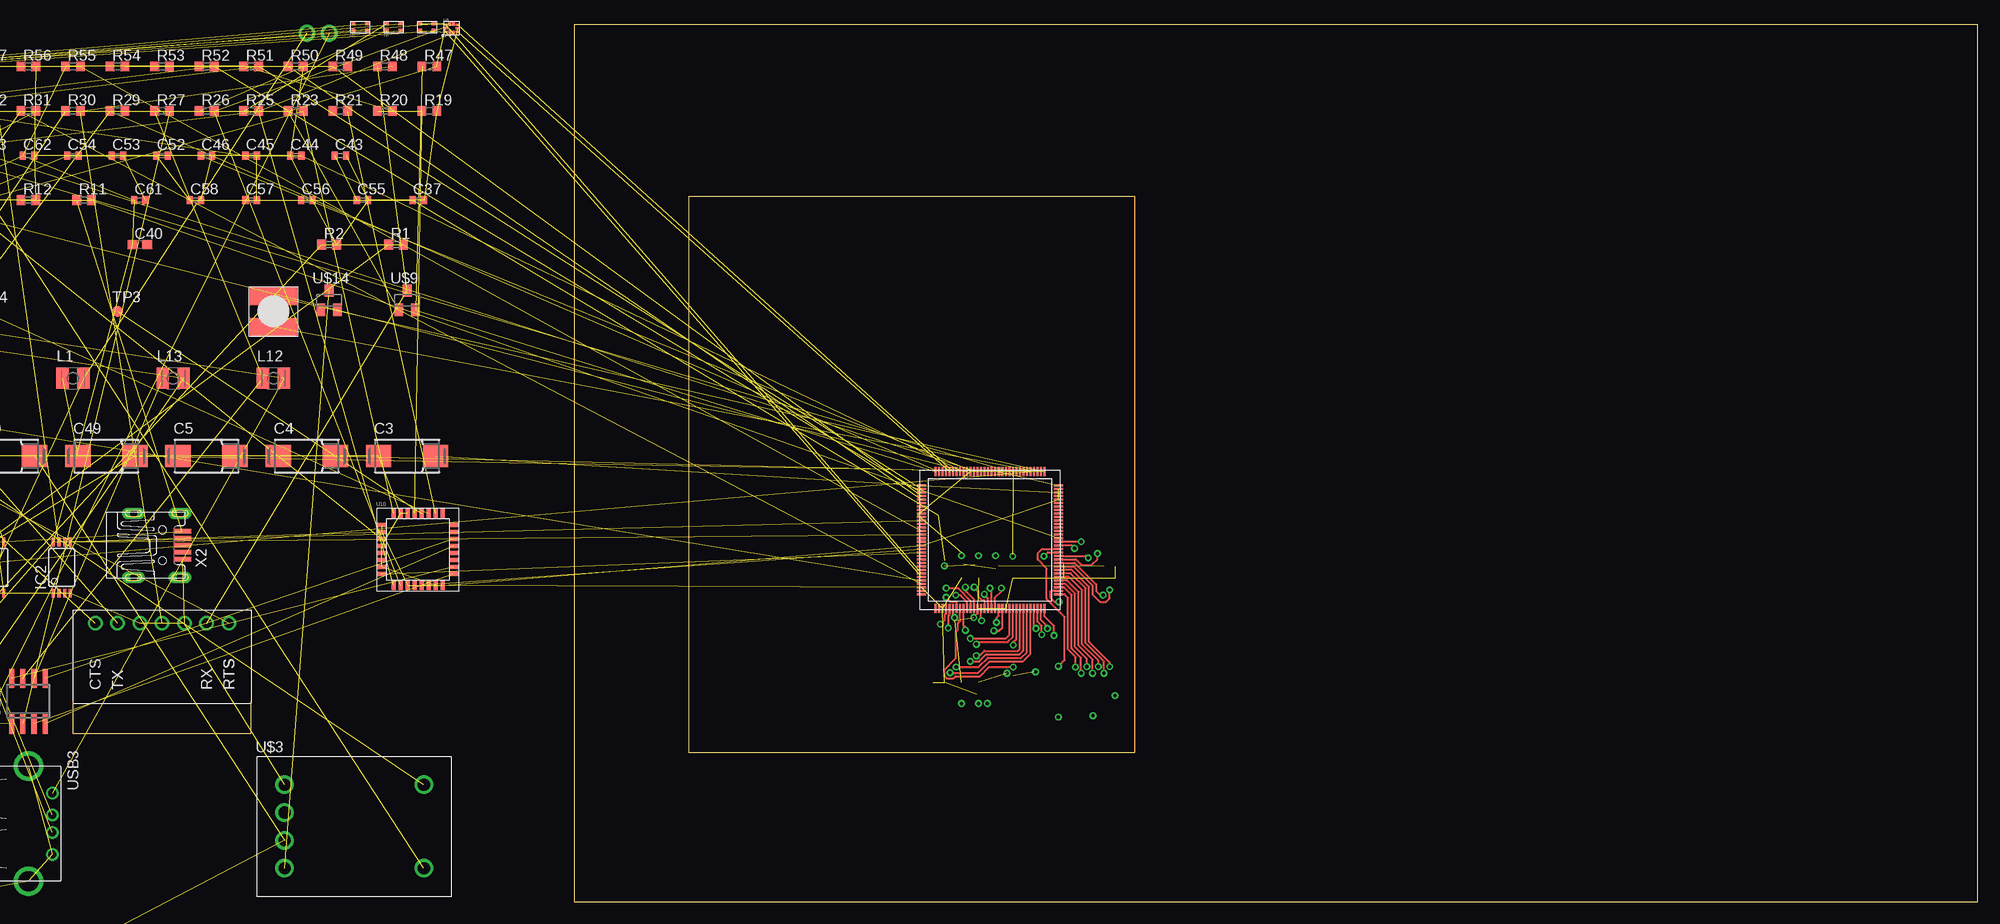
[diagram p6: board, top side]
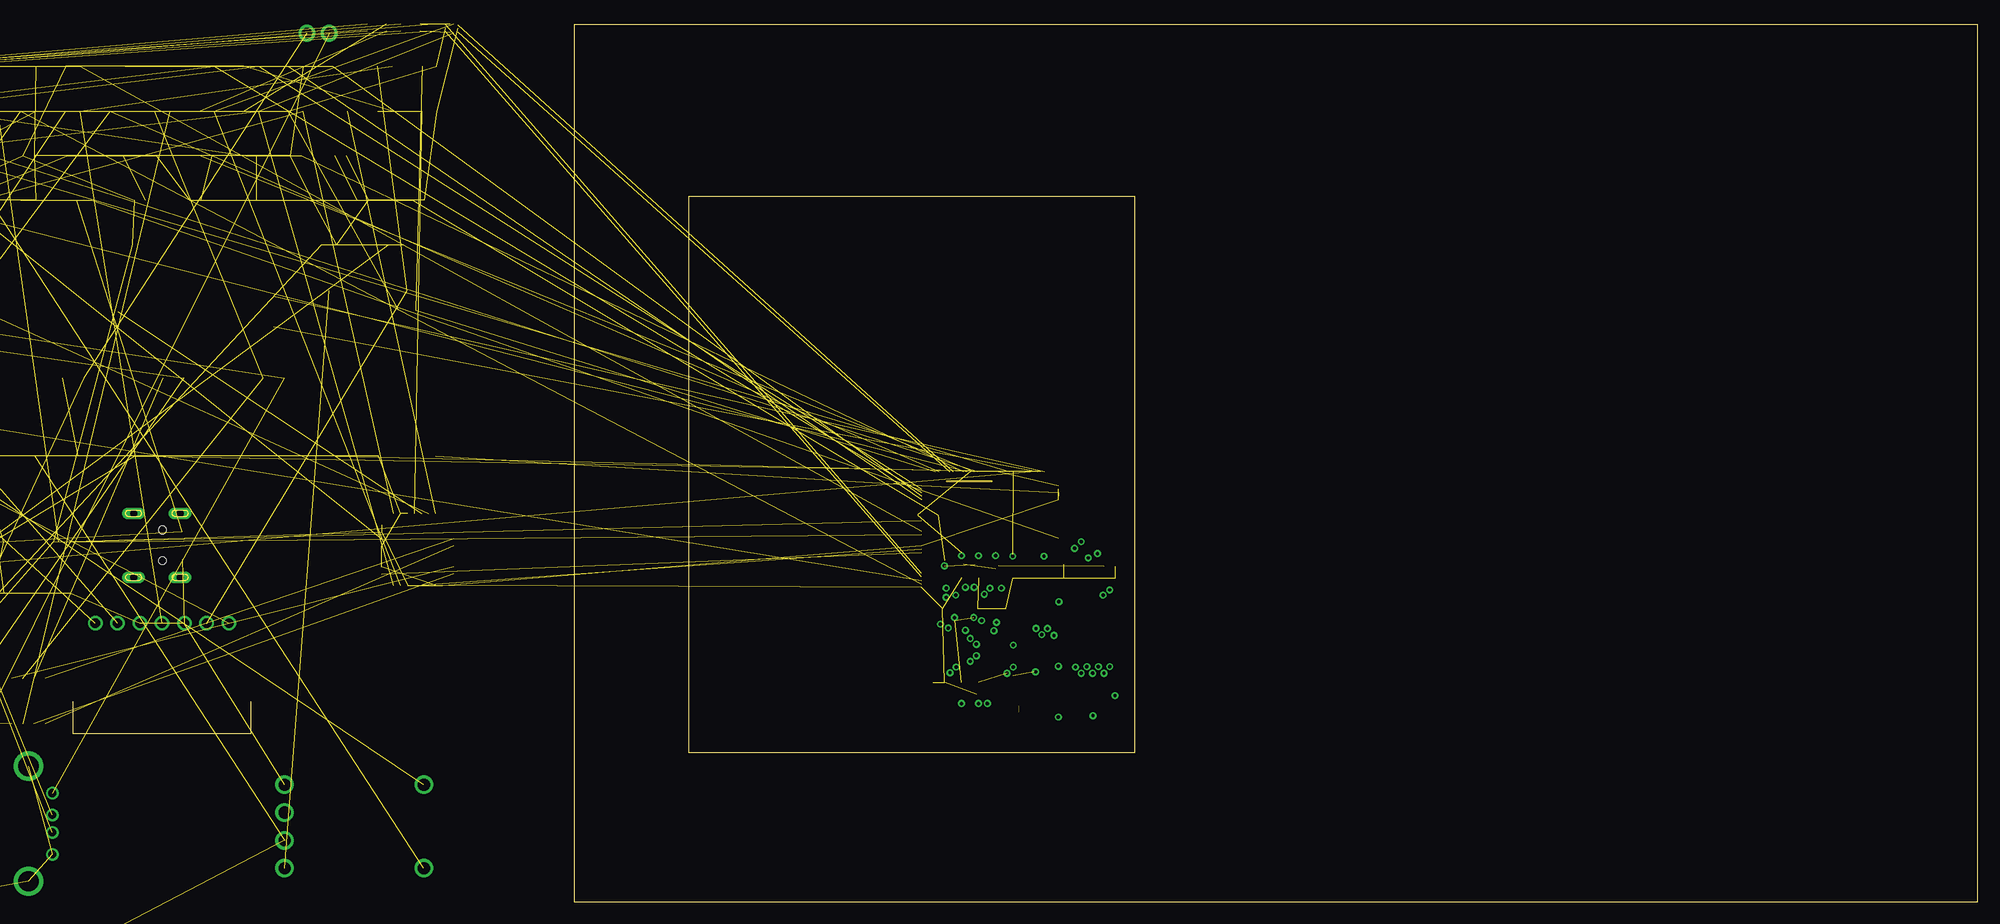
[diagram p7: board, inner layer Route2]
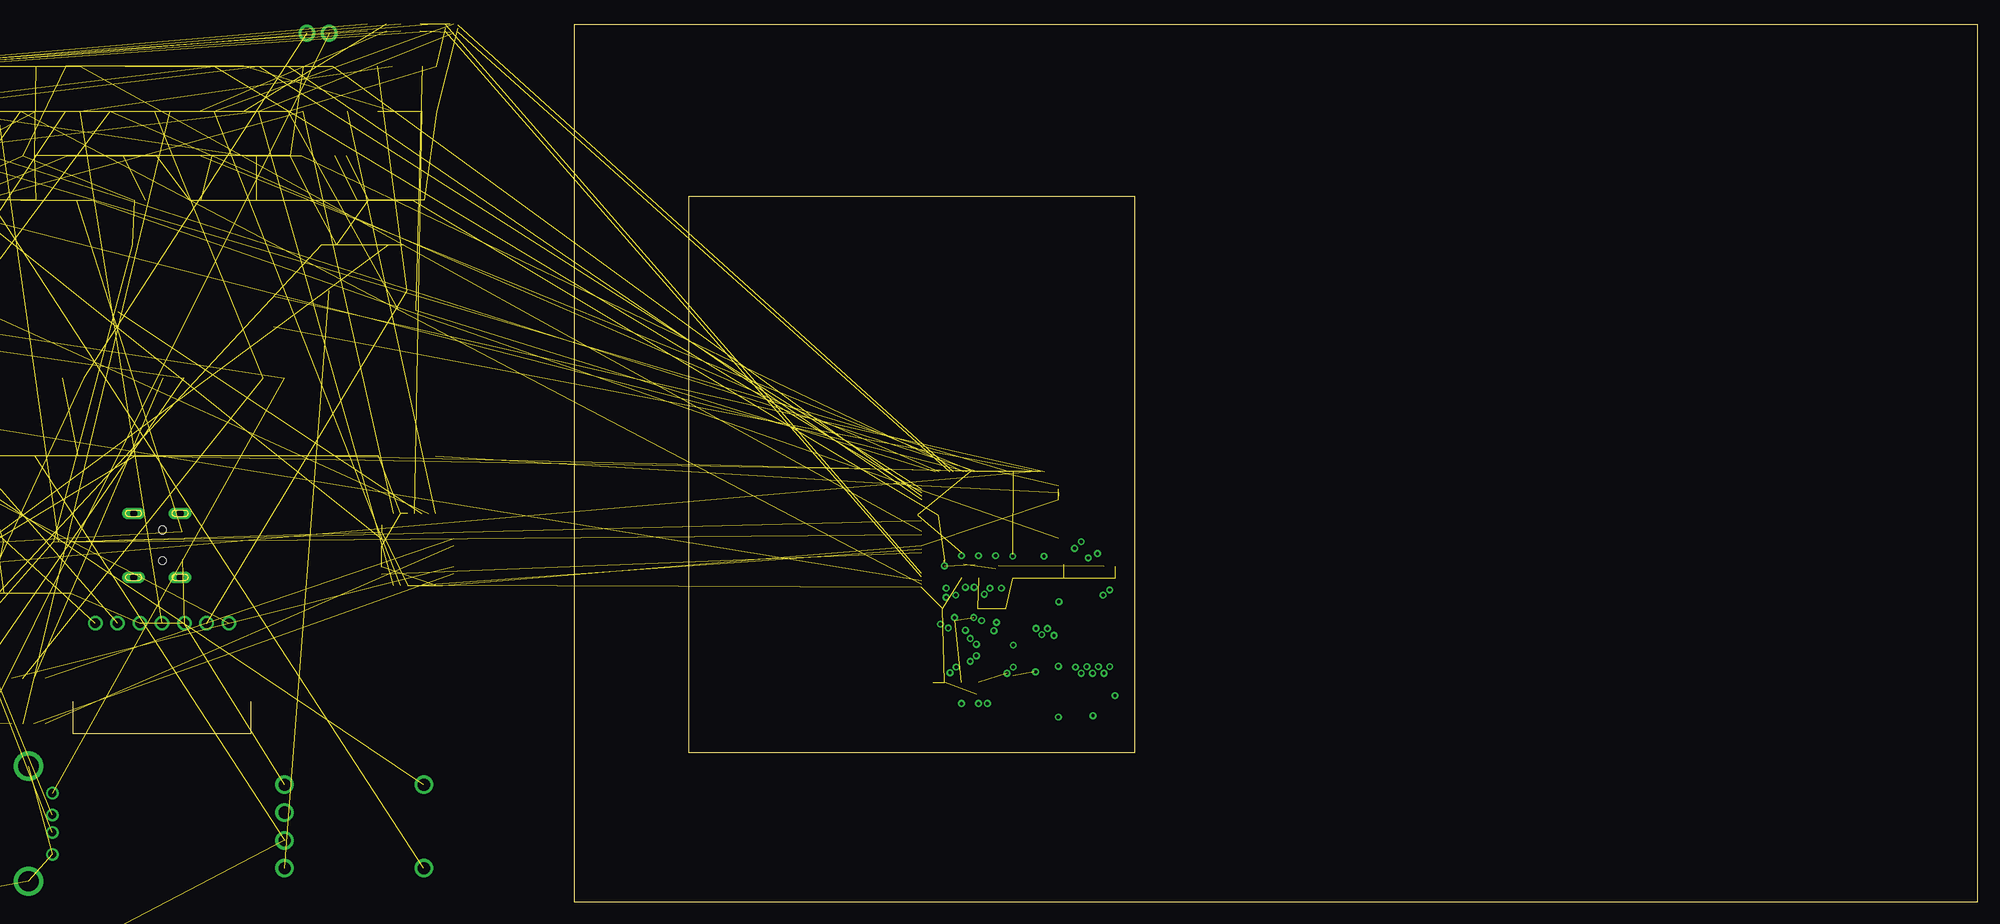
[diagram p8: board, inner layer Route15]
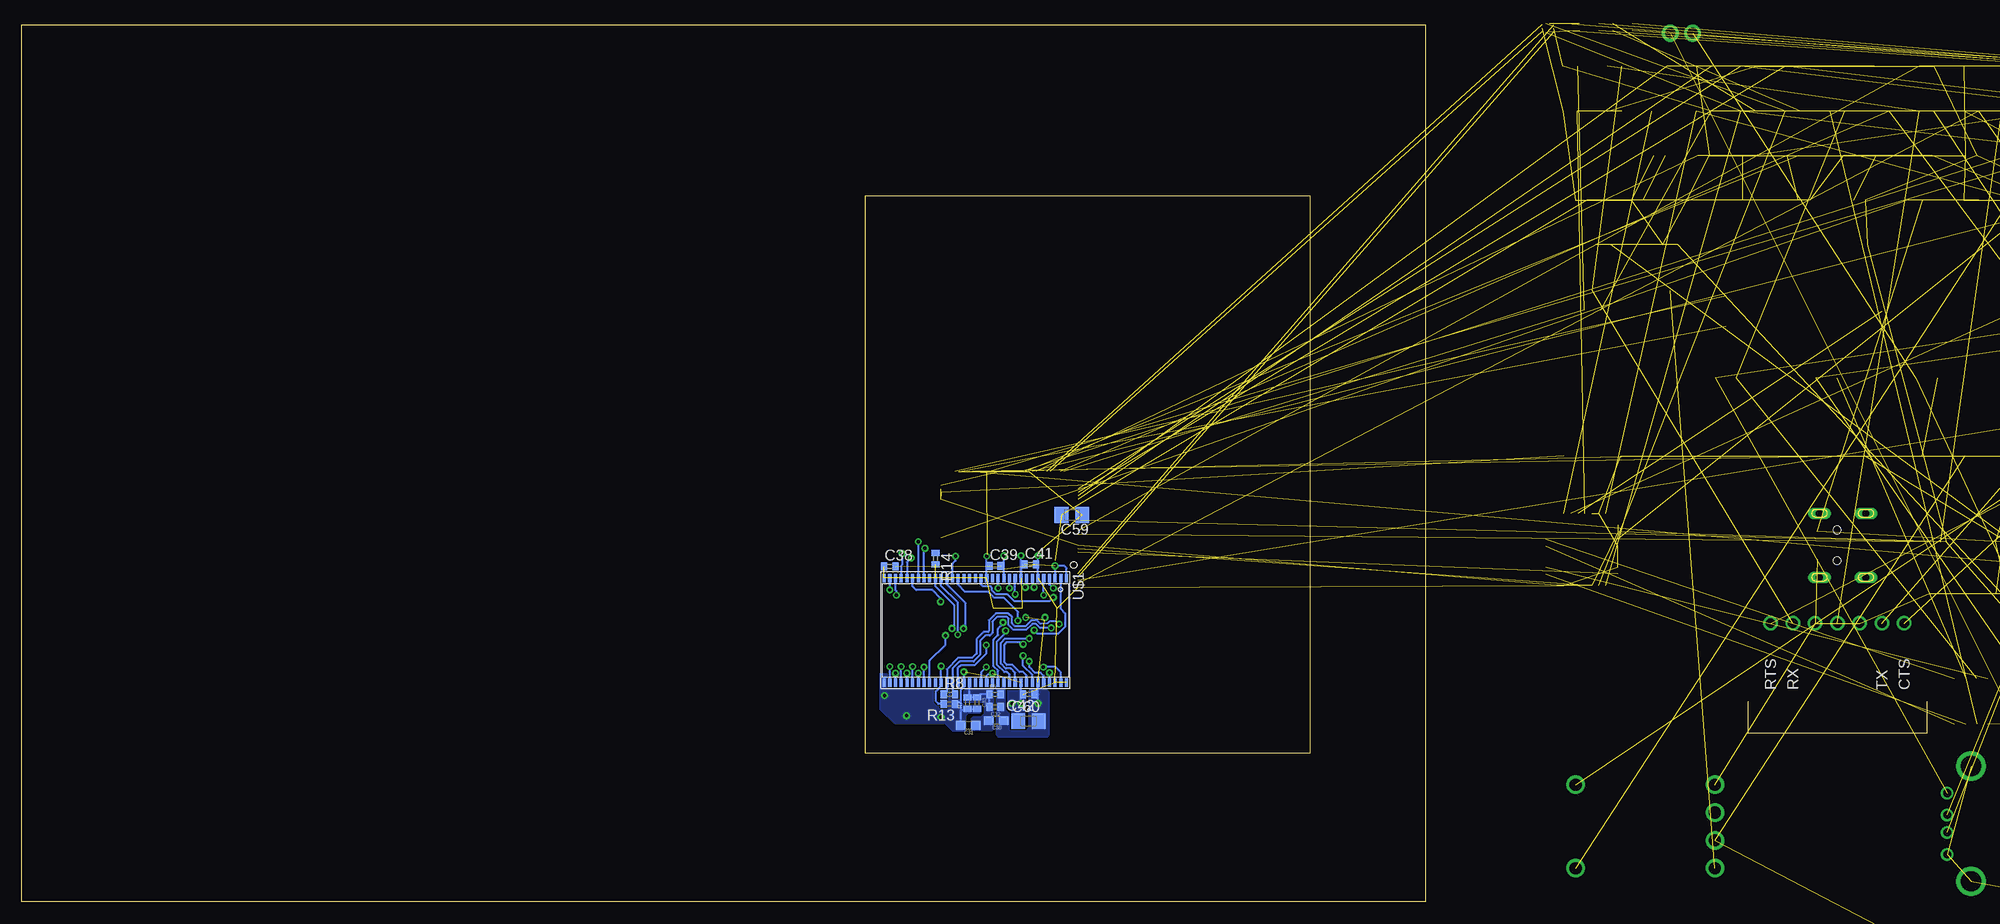
[diagram p9: board, bottom side, seen from below]

Size 160 x 100 mm. Coordinates in mm from the lower left corner, seen from the top.
Outline: 0,0 160,0 160,100 0,100 0,0
Copper layers (1*2+15*16): Top 0.035mm / dielectric 1.5mm / Route2 0.035mm / dielectric 0.15mm / Route15 0.035mm / dielectric 0.2mm / Bottom 0.035mm
Design rules "default *": minimum track width 6mil, minimum drill 15mil, track to track 6mil, track to pad 6mil, pad to pad 6mil, via to via 6mil, smd to smd 6mil, copper to edge 10mil, drill to drill 6mil, minimum pad ring 10mil, minimum via ring 8mil, stop-mask expansion 4mil, vias tented up to drill 0mil, thermal gap 10mil

### Footprints (pad centres in the part's own frame; a part is rotated, then mirrored left to right if it is on the bottom)
085CS_1AR = smd 2.9 x 2.5: + 3.25,0; - -3.25,0
C0603 = smd 1.1 x 1: 1 -0.85,0; 2 0.85,0
C0402 = smd 0.7 x 0.9: 1 -0.65,0; 2 0.65,0
E1,8-4 = drill 0.711 pad 1.168 round: + -0.889,0 | drill 0.711 pad 1.168 octagon: - 0.889,0
R/2012-12R = smd 1.55 x 1.8: + 1.175,0; - -1.175,0
TSSOP8 = smd 0.35 x 1: 1 -0.975,-2.925; 2 -0.325,-2.925; 3 0.325,-2.925; 4 0.975,-2.925; 5 0.975,2.925; 6 0.325,2.925; 7 -0.325,2.925; 8 -0.975,2.925
L2825P = smd 1.4 x 2.4: 1 -1.2,0; 2 1.2,0
SPLIT_0805 = smd 0.45 x 0.4: 1 0.225,-0.2; 2 1.775,-0.2; 3 1.775,-1; 4 0.225,-1
SRR4028 = smd 5.3 x 2: 1 0,1.75; 2 0,-1.75
CMA-4544PF-W = drill 0.65 round: 1 2.5,0; 2 0,0
R0603 = smd 1 x 1.1: 1 -0.85,0; 2 0.85,0
R0402 = smd 0.7 x 0.9: 1 -0.65,0; 2 0.65,0
B1,27 = smd 1.27 x 1.27: TP 0,0
TQFP10 = smd 0.25 x 0.55: 1 -0.2,-1.175 | smd 0.25 x 0.45: 2 0.2,-1.225; 6 0.2,-0.225; 7 -0.2,-0.225 | smd 0.45 x 0.25: 3 0.7,-1.125; 4 0.7,-0.725; 5 0.7,-0.325; 8 -0.7,-0.325; 9 -0.7,-0.725; 10 -0.7,-1.125
SOT-523 = smd 0.4 x 0.8: 1 0,0; 2 1,0; 3 0.5,1.4
S-PQFP-G32 = smd 0.45 x 1: 1 -2.8,0.5; 2 -2,0.5; 3 -1.2,0.5; 4 -0.4,0.5; 5 0.4,0.5; 6 1.2,0.5; 7 2,0.5; 8 2.8,0.5; 17 2.8,8.7; 18 2,8.7; 19 1.2,8.7; 20 0.4,8.7; 21 -0.4,8.7; 22 -1.2,8.7; 23 -2,8.7; 24 -2.8,8.7 | smd 1 x 0.45: 9 4.05,1.8; 10 4.05,2.6; 11 4.05,3.4; 12 4.05,4.2; 13 4.05,5; 14 4.05,5.8; 15 4.05,6.6; 16 4.05,7.4; 25 -4.15,7.4; 26 -4.15,6.6; 27 -4.15,5.8; 28 -4.15,5; 29 -4.15,4.2; 30 -4.15,3.4; 31 -4.15,2.6; 32 -4.15,1.8
SO08 = smd 0.6 x 2.2: 1 -1.905,-2.6; 2 -0.635,-2.6; 3 0.635,-2.6; 4 1.905,-2.6; 5 1.905,2.6; 6 0.635,2.6; 7 -0.635,2.6; 8 -1.905,2.6
66TSOP2 = smd 0.35 x 1: P$1 0,0; P$2 -0.65,0; P$3 -1.3,0; P$4 -1.95,0; P$5 -2.6,0; P$6 -3.25,0; P$7 -3.9,0; P$8 -4.55,0; P$9 -5.2,0; P$10 -5.85,0; P$11 -6.5,0; P$12 -7.15,0; P$13 -7.8,0; P$14 -8.45,0; P$15 -9.1,0; P$16 -9.75,0; P$17 -10.4,0; P$18 -11.05,0; P$19 -11.7,0; P$20 -12.35,0; P$21 -13,0; P$22 -13.65,0; P$23 -14.3,0; P$24 -14.95,0; P$25 -15.6,0; P$26 -16.25,0; P$27 -16.9,0; P$28 -17.55,0; P$29 -18.2,0; P$30 -18.85,0; P$31 -19.5,0; P$32 -20.15,0; P$33 -20.8,0; P$34 -20.8,-11.91; P$35 -20.15,-11.91; P$36 -19.5,-11.91; P$37 -18.85,-11.91; P$38 -18.2,-11.91; P$39 -17.55,-11.91; P$40 -16.9,-11.91; P$41 -16.25,-11.91; P$42 -15.6,-11.91; P$43 -14.95,-11.91; P$44 -14.3,-11.91; P$45 -13.65,-11.91; P$46 -13,-11.91; P$47 -12.35,-11.91; P$48 -11.7,-11.91; P$49 -11.05,-11.91; P$50 -10.4,-11.91; P$51 -9.75,-11.91; P$52 -9.1,-11.91; P$53 -8.45,-11.91; P$54 -7.8,-11.91; P$55 -7.15,-11.91; P$56 -6.5,-11.91; P$57 -5.85,-11.91; P$58 -5.2,-11.91; P$59 -4.55,-11.91; P$60 -3.9,-11.91; P$61 -3.25,-11.91; P$62 -2.6,-11.91; P$63 -1.95,-11.91; P$64 -1.3,-11.91; P$65 -0.65,-11.91; P$66 0,-11.91
0154 = smd 4.24 x 3.81: 1 0,0; 2 6.38,0
PTH08000W = drill 1.4 round: 1 0,9.525; 2 0,6.35; 3 0,3.175; 4 0,0; 5 15.875,0; 6 15.875,9.525
AMPHENOL_USD = smd 0.6 x 1.05: 1 10.43,2.49; 2 9.33,2.49; 3 8.23,2.49; 4 7.13,2.49; 5 6.03,2.49; 6 4.93,2.49; 7 3.83,2.49; 8 2.73,2.49 | smd 1.05 x 1.05: P$1 0,0; P$2 14.5,0; P$3 0,8.4; P$4 14.5,8.4
SOT23 = smd 1 x 1.4: 1 -0.95,-1.1; 2 0.95,-1.1; 3 0,1.1
WASP7PIN = drill 1.1 round: CTS 0,0; GND 5.08,0; GND1 10.16,0; RTS 15.24,0; RX 12.7,0; TX 2.54,0; VCC 7.62,0
DO-214AB = smd 1.778 x 5.08: AN -0.889,2.54; CAT 5.715,2.54
2PTH = drill 1.168 pad 1.93 round: P$1 -2.54,0; P$2 0,0
14MM_128TQFP_E0.40 = smd 1 x 0.23: 1 -0.8,-0.8; 2 -0.8,-1.2; 3 -0.8,-1.6; 4 -0.8,-2; 5 -0.8,-2.4; 6 -0.8,-2.8; 7 -0.8,-3.2; 8 -0.8,-3.6; 9 -0.8,-4; 10 -0.8,-4.4; 11 -0.8,-4.8; 12 -0.8,-5.2; 13 -0.8,-5.6; 14 -0.8,-6; 15 -0.8,-6.4; 16 -0.8,-6.8; 17 -0.8,-7.2; 18 -0.8,-7.6; 19 -0.8,-8; 20 -0.8,-8.4; 21 -0.8,-8.8; 22 -0.8,-9.2; 23 -0.8,-9.6; 24 -0.8,-10; 25 -0.8,-10.4; 26 -0.8,-10.8; 27 -0.8,-11.2; 28 -0.8,-11.6; 29 -0.8,-12; 30 -0.8,-12.4; 31 -0.8,-12.8; 32 -0.8,-13.2; 65 14.8,-13.2; 66 14.8,-12.8; 67 14.8,-12.4; 68 14.8,-12; 69 14.8,-11.6; 70 14.8,-11.2; 71 14.8,-10.8; 72 14.8,-10.4; 73 14.8,-10; 74 14.8,-9.6; 75 14.8,-9.2; 76 14.8,-8.8; 77 14.8,-8.4; 78 14.8,-8; 79 14.8,-7.6; 80 14.8,-7.2; 81 14.8,-6.8; 82 14.8,-6.4; 83 14.8,-6; 84 14.8,-5.6; 85 14.8,-5.2; 86 14.8,-4.8; 87 14.8,-4.4; 88 14.8,-4; 89 14.8,-3.6; 90 14.8,-3.2; 91 14.8,-2.8; 92 14.8,-2.4; 93 14.8,-2; 94 14.8,-1.6; 95 14.8,-1.2; 96 14.8,-0.8 | smd 0.23 x 1: 33 0.8,-14.8; 34 1.2,-14.8; 35 1.6,-14.8; 36 2,-14.8; 37 2.4,-14.8; 38 2.8,-14.8; 39 3.2,-14.8; 40 3.6,-14.8; 41 4,-14.8; 42 4.4,-14.8; 43 4.8,-14.8; 44 5.2,-14.8; 45 5.6,-14.8; 46 6,-14.8; 47 6.4,-14.8; 48 6.8,-14.8; 49 7.2,-14.8; 50 7.6,-14.8; 51 8,-14.8; 52 8.4,-14.8; 53 8.8,-14.8; 54 9.2,-14.8; 55 9.6,-14.8; 56 10,-14.8; 57 10.4,-14.8; 58 10.8,-14.8; 59 11.2,-14.8; 60 11.6,-14.8; 61 12,-14.8; 62 12.4,-14.8; 63 12.8,-14.8; 64 13.2,-14.8; 97 13.2,0.8; 98 12.8,0.8; 99 12.4,0.8; 100 12,0.8; 101 11.6,0.8; 102 11.2,0.8; 103 10.8,0.8; 104 10.4,0.8; 105 10,0.8; 106 9.6,0.8; 107 9.2,0.8; 108 8.8,0.8; 109 8.4,0.8; 110 8,0.8; 111 7.6,0.8; 112 7.2,0.8; 113 6.8,0.8; 114 6.4,0.8; 115 6,0.8; 116 5.6,0.8; 117 5.2,0.8; 118 4.8,0.8; 119 4.4,0.8; 120 4,0.8; 121 3.6,0.8; 122 3.2,0.8; 123 2.8,0.8; 124 2.4,0.8; 125 2,0.8; 126 1.6,0.8; 127 1.2,0.8; 128 0.8,0.8
USB-A-H = drill 0.914 round: D+ 2.718,-1.003; D- 2.718,1.003; GND 2.718,-3.493; VBUS 2.718,3.493 | drill 2.311 round: GND@1 0,6.566; GND@2 0,-6.566
UX60-MB-5S8 = smd 2 x 0.5: 1 8.65,1.6; 2 8.65,0.8; 3 8.65,0; 4 8.65,-0.8; 5 8.65,-1.6 | drill 0.8 long: M1 3.1,-3.65; M2 3.1,3.65; M3 8.4,3.65; M4 8.4,-3.65 | hole 0.9: 6.4,-1.75; 6.4,1.75

### Placement (x,y rotation side)
C1  -76.2,38.1 0 top  (outside the outline)
C2  -87.63,38.1 0 top  (outside the outline)
C3  -19.05,50.8 0 top  (outside the outline)
C4  -30.48,50.8 0 top  (outside the outline)
C5  -41.91,50.8 0 top  (outside the outline)
C6  -97.79,-93.98 0 top  (outside the outline)
C7  -93.98,-68.58 0 top  (outside the outline)
C8  -93.98,-78.74 0 top  (outside the outline)
C14  -80.01,80.01 0 top  (outside the outline)
C29  -85.09,80.01 0 top  (outside the outline)
C30  48.9,20.65 180 bottom
C31  52.1,20.1 180 bottom
C32  49.05,22.2 180 bottom
C33  51.1,22.65 270 bottom
C34  -87.63,74.93 0 top  (outside the outline)
C35  -93.98,74.93 0 top  (outside the outline)
C36  -81.28,74.93 0 top  (outside the outline)
C37  -17.78,80.01 0 top  (outside the outline)
C38  61.05,38.25 0 bottom
C39  49.05,38.3 0 bottom
C40  -49.53,74.93 0 top  (outside the outline)
C41  45.05,38.45 0 bottom
C42  45.2,23.65 180 bottom
C43  -26.67,85.09 0 top  (outside the outline)
C44  -31.75,85.09 0 top  (outside the outline)
C45  -36.83,85.09 0 top  (outside the outline)
C46  -41.91,85.09 0 top  (outside the outline)
C47  -81.28,67.31 0 top  (outside the outline)
C48  -95.25,67.31 0 top  (outside the outline)
C49  -53.34,50.8 0 top  (outside the outline)
C50  -64.77,50.8 0 top  (outside the outline)
C51  -76.2,50.8 0 top  (outside the outline)
C52  -46.99,85.09 0 top  (outside the outline)
C53  -52.07,85.09 0 top  (outside the outline)
C54  -57.15,85.09 0 top  (outside the outline)
C55  -24.13,80.01 0 top  (outside the outline)
C56  -30.48,80.01 0 top  (outside the outline)
C57  -36.83,80.01 0 top  (outside the outline)
C58  -43.18,80.01 0 top  (outside the outline)
C59  40.3,44.1 180 bottom
C60  45.25,20.6 0 bottom
C61  -49.53,80.01 0 top  (outside the outline)
C62  -62.23,85.09 0 top  (outside the outline)
C63  -67.31,85.09 0 top  (outside the outline)
C64  -87.63,85.09 0 top  (outside the outline)
C65  -72.39,85.09 0 top  (outside the outline)
IC2  -58.42,38.1 0 top  (outside the outline)
L1  -57.15,59.69 0 top  (outside the outline)
L3  -96.52,-3.81 0 top  (outside the outline)
L4  -96.52,-12.7 0 top  (outside the outline)
L5  -96.52,-41.91 0 top  (outside the outline)
L6  -17.78,100.33 0 top  (outside the outline)
L7  -96.52,-59.69 0 top  (outside the outline)
L9  -34.29,67.31 0 top  (outside the outline)
L10  -21.59,100.33 0 top  (outside the outline)
L11  -25.4,100.33 0 top  (outside the outline)
L12  -34.29,59.69 0 top  (outside the outline)
L13  -45.72,59.69 0 top  (outside the outline)
M1  -90.17,24.13 0 top  (outside the outline)
R1  -20.32,74.93 0 top  (outside the outline)
R2  -27.94,74.93 0 top  (outside the outline)
R3  -72.39,95.25 0 top  (outside the outline)
R4  -87.63,95.25 0 top  (outside the outline)
R5  -77.47,95.25 0 top  (outside the outline)
R6  49.05,23.65 0 bottom
R7  52.2,22.65 90 bottom
R8  54.25,23.65 0 bottom
R11  -55.88,80.01 0 top  (outside the outline)
R12  -62.23,80.01 0 top  (outside the outline)
R13  54.25,22.55 180 bottom
R14  55.85,39.1 270 bottom
R19  -16.51,90.17 0 top  (outside the outline)
R20  -21.59,90.17 0 top  (outside the outline)
R21  -26.67,90.17 0 top  (outside the outline)
R22  -77.47,85.09 0 top  (outside the outline)
R23  -31.75,90.17 0 top  (outside the outline)
R24  -68.58,80.01 0 top  (outside the outline)
R25  -36.83,90.17 0 top  (outside the outline)
R26  -41.91,90.17 0 top  (outside the outline)
R27  -46.99,90.17 0 top  (outside the outline)
R29  -52.07,90.17 0 top  (outside the outline)
R30  -57.15,90.17 0 top  (outside the outline)
R31  -62.23,90.17 0 top  (outside the outline)
R32  -67.31,90.17 0 top  (outside the outline)
R33  -72.39,90.17 0 top  (outside the outline)
R34  -74.93,80.01 0 top  (outside the outline)
R35  -77.47,90.17 0 top  (outside the outline)
R36  -82.55,90.17 0 top  (outside the outline)
R37  -82.55,85.09 0 top  (outside the outline)
R38  -87.63,90.17 0 top  (outside the outline)
R45  -92.71,90.17 0 top  (outside the outline)
R46  -97.79,90.17 0 top  (outside the outline)
R47  -16.51,95.25 0 top  (outside the outline)
R48  -21.59,95.25 0 top  (outside the outline)
R49  -26.67,95.25 0 top  (outside the outline)
R50  -31.75,95.25 0 top  (outside the outline)
R51  -36.83,95.25 0 top  (outside the outline)
R52  -41.91,95.25 0 top  (outside the outline)
R53  -46.99,95.25 0 top  (outside the outline)
R54  -52.07,95.25 0 top  (outside the outline)
R55  -57.15,95.25 0 top  (outside the outline)
R56  -62.23,95.25 0 top  (outside the outline)
R57  -67.31,95.25 0 top  (outside the outline)
TP3  -52.07,67.31 0 top  (outside the outline)
TP4  -67.31,67.31 0 top  (outside the outline)
U1  -66.04,38.1 0 top  (outside the outline)
U6  -13.97,100.33 0 top  (outside the outline)
U7  -91.44,93.98 0 top  (outside the outline)
U8  -93.98,93.98 0 top  (outside the outline)
U9  -96.52,93.98 0 top  (outside the outline)
U10  -17.78,35.56 0 top  (outside the outline)
U13  -62.23,22.86 0 top  (outside the outline)
U$1  40.9,36.9 0 bottom
U$2  -96.52,-22.86 0 top  (outside the outline)
U$3  -33.02,3.81 0 top  (outside the outline)
U$4  -82.55,20.32 0 top  (outside the outline)
U$5  -77.47,59.69 0 top  (outside the outline)
U$6  -86.36,59.69 0 top  (outside the outline)
U$7  -95.25,59.69 0 top  (outside the outline)
U$8  [OUTLINE]  63.9,16.95 0 bottom
U$9  -19.05,68.58 0 top  (outside the outline)
U$10  -54.61,31.75 0 top  (outside the outline)
U$11  -96.52,-31.75 0 top  (outside the outline)
U$12  -95.25,-35.56 0 top  (outside the outline)
U$13  40.4,48.25 0 top
U$14  -27.94,68.58 0 top  (outside the outline)
U$15  -27.94,99.06 0 top  (outside the outline)
U$16  -97.79,-88.9 0 top  (outside the outline)
USB3  -62.23,8.89 0 top  (outside the outline)
USB4  -80.01,8.89 0 top  (outside the outline)
X2  -53.34,40.64 0 top  (outside the outline)

### Tracks (layer width: path | path; a pad name or v marks a point on that pad's centre or on a via)
5V_SWITCH_STAT  (1 unrouted)
!OC1  (1 unrouted)
!OC2  (1 unrouted)
!PW1  (1 unrouted)
!PW2  (1 unrouted)
+3V3  (10 unrouted)
+5V  (4 unrouted)
BATT_RAW_7V2  (5 unrouted)
BOWLER_CTS_LV  (2 unrouted)
BOWLER_RTS_LV  (2 unrouted)
BOWLER_RX_LV  (2 unrouted)
BOWLER_TX_LV  (2 unrouted)
CTS_HV  (2 unrouted)
DCDC_LIN1  (1 unrouted)
DCDC_LP1  (1 unrouted)
DEV_D+  (1 unrouted)
DEV_D-  (1 unrouted)
DEV_D-_UNFILTERED1  (1 unrouted)
DEV_VBUS  (2 unrouted)
EMI_!CAS  (via drill 0.38)
  Top 0.2: U$13.61 52.4,31.4 v52.65,31.15
  Bottom 0.2: v52.65,31.15 52.4,31.4 52.4,34.05 54.55,36.2 U$1.P$22
EMI_!CLK  (via drill 0.38)
  Top 0.2: U$13.37 42.8,32.75 42.65,32.6 v42.65,31.2
  Bottom 0.2: R8.2 53.9,23.95 U$1.P$46 53.9,26.6 53.1,27.4 51.5,27.4 50.75,28.15 50.75,29.75 50.15,30.35 49.65,30.35 49.35,30.65 49.35,31.95 48.8,32.5 47.7,32.5 47.5,32.3 47.5,31.55 46.95,31 45.5,31 44.8,31.7 44.4,31.7 43.9,31.2 v42.65,31.2
EMI_!CS  (via drill 0.38)  (1 unrouted)
  Top 0.2: U$13.63 53.2,32.15 53.7,31.65 53.7,31.4 v53.95,31.15
  Bottom 0.2: v53.95,31.15 53.7,31.4 53.7,33.8 55.85,35.95 U$1.P$24
EMI_!RAS  (via drill 0.38)
  Top 0.2: U$13.62 52.8,31.95 53.3,31.45 v53.3,30.45
  Bottom 0.2: v53.3,30.45 53.3,34.1 55.2,36 U$1.P$23
EMI_!WE  (via drill 0.38)
  Top 0.2: U$13.77 54,39.85 v53.55,39.4
  Bottom 0.2: v53.55,39.4 53.55,38.9 53.9,38.55 U$1.P$21
EMI_A0  (via drill 0.38)
  Top 0.2: U$13.76 58.35,39.45 v58.6,39.2
  Bottom 0.2: U$1.P$29 59.1,38.7 v58.6,39.2
EMI_A1  (via drill 0.38)
  Top 0.2: U$13.75 57.2,39.05 57.85,38.4 59,38.4 59.65,39.05 v59.65,39.7
  Bottom 0.2: v59.65,39.7 59.65,38.4 59.75,38.3 U$1.P$30
EMI_A2  (via drill 0.38)
  Top 0.2: U$13.74 57.05,38.65 59.5,36.2 59.5,35.45 60,34.95 v60.3,34.95
  Bottom 0.2: U$1.P$31 60.4,35.55 60.3,35.45 v60.3,34.95
EMI_A3  (via drill 0.38)
  Top 0.2: U$13.73 56.9,38.25 59.1,36.05 59.1,35.05 59.95,34.2 60.65,34.2 61.05,34.6 v61.05,35.55
  Bottom 0.2: v61.05,35.55 U$1.P$32
EMI_A4  (via drill 0.38)
  Top 0.2: v61.05,26.8 61.05,27.3 58.7,29.65 58.7,35.9 56.75,37.85 U$13.72
  Bottom 0.2: U$1.P$35 v61.05,26.8
EMI_A5  (via drill 0.38)
  Top 0.2: U$13.71 56.6,37.45 58.3,35.75 58.3,29.5 60.4,27.4 v60.4,26.05
  Bottom 0.2: U$1.P$36 v60.4,26.05
EMI_A6  (via drill 0.38)
  Top 0.2: U$13.70 56.4,37.05 57.9,35.55 57.9,29.35 59.75,27.5 v59.75,26.8
  Bottom 0.2: U$1.P$37 v59.75,26.8
EMI_A7  (via drill 0.38)
  Top 0.2: U$13.69 56.2,36.65 57.5,35.35 57.5,29.2 59.1,27.6 v59.1,26.05
  Bottom 0.2: U$1.P$38 v59.1,26.05
EMI_A8  (via drill 0.38)
  Top 0.2: U$13.68 56,36.25 57.1,35.15 57.1,29.05 58.45,27.7 v58.45,26.8
  Bottom 0.2: U$1.P$39 v58.45,26.8
EMI_A9  (via drill 0.38)
  Top 0.2: U$13.67 55.85,35.85 56.7,35 56.7,28.9 57.8,27.8 v57.8,26.05
  Bottom 0.2: U$1.P$40 v57.8,26.05
EMI_A10  (via drill 0.38)
  Top 0.2: U$13.66 54.4,35.45 54.25,35.3 54.25,34.7 54.75,34.2 v55.25,34.2
  Bottom 0.2: v55.25,34.2 55.25,34.6 56.2,35.55 58.05,35.55 58.45,35.95 U$1.P$28
EMI_A11  (via drill 0.38)
  Top 0.2: U$13.65 55.9,35.05 56.3,34.65 56.3,28.75 57.15,27.9 v57.15,26.75
  Bottom 0.2: U$1.P$41 v57.15,26.75
EMI_A12  (via drill 0.38)
  Top 0.2: U$13.64 53.6,32.55 54.7,31.45 v54.7,30.35
  Bottom 0.2: v54.7,30.35 54.7,29.3 56.5,27.5 U$1.P$42
EMI_BA0  (via drill 0.38)
  Top 0.2: U$13.79 56.7,40.65 v57.05,40.3
  Bottom 0.2: v57.05,40.3 57.15,40.2 U$1.P$26
EMI_BA1  (via drill 0.38)
  Top 0.2: U$13.80 v57.8,41.05 57.8,41.15
  Bottom 0.2: U$1.P$27 v57.8,41.05
EMI_CKE  (via drill 0.38)
  Top 0.2: v55.2,26.85 55.9,27.55 55.9,32.5 53.85,34.55 53.85,38 52.85,39 52.85,39.75 53.35,40.25 U$13.78
  Bottom 0.2: v55.2,26.85 U$1.P$44 55.2,24.6 55.8,24 55.8,22.85 55.5,22.55 R13.2
EMI_CLK  (via drill 0.38)
  Top 0.2: v41.75,31.65 42.25,32.15 42.25,32.7 42.4,32.85 U$13.36
  Bottom 0.2: R8.1 54.55,23.9 U$1.P$45 54.55,26.5 53.25,27.8 51.65,27.8 51.15,28.3 51.15,29.95 50.35,30.75 49.85,30.75 49.75,30.85 49.75,32.1 48.95,32.9 47.55,32.9 47.1,32.45 47.1,31.75 46.75,31.4 45.6,31.4 44.9,32.1 44.25,32.1 43.85,31.7 43.05,31.75 42.85,31.95 42.05,31.95 v41.75,31.65
EMI_D0  (via drill 0.38)
  Top 0.2: U$13.41 44.4,31.45 44.6,31.25 v44.6,30.95
  Bottom 0.2: v44.6,30.95 44.2,30.55 41.85,30.55 41.05,31.35 41.05,32.9 41.55,33.4 U$1.P$2
EMI_D1  (via drill 0.38)
  Top 0.2: v42.4,35.75 43.75,35.75 45.2,34.3 U$13.43
  Bottom 0.2: U$1.P$4 42.85,36.15 42.45,35.75 v42.4,35.75
EMI_D2  (via drill 0.38)
  Top 0.2: U$13.42 44.8,34.2 44.05,34.95 v43.5,34.95
  Bottom 0.2: v43.5,34.95 U$1.P$5
EMI_D3  (via drill 0.38)
  Top 0.2: U$13.44 45.6,34.45 44.6,35.45 v44.6,35.85
  Bottom 0.2: U$1.P$7 44.8,36.35 44.6,36.15 v44.6,35.85
EMI_D4  (via drill 0.38)
  Top 0.2: v45.6,35.85 46.05,35.45 46.05,34.8 46.45,34.4 46.65,34.4 46.8,34.25 U$13.47
  Bottom 0.2: U$1.P$8 45.45,36 v45.6,35.85
EMI_D5  (via drill 0.38)
  Top 0.2: v46.75,35.05 47.2,34.6 U$13.48
  Bottom 0.2: v46.75,35.05 U$1.P$10
EMI_D6  (via drill 0.38)
  Top 0.2: v47.4,35.75 47.6,35.55 U$13.49
  Bottom 0.2: v47.4,35.75 U$1.P$11
EMI_D7  (via drill 0.38)
  Top 0.2: v48.7,35.75 48.7,35.4 48,34.7 U$13.50
  Bottom 0.2: v48.7,35.75 U$1.P$13
EMI_D8  (via drill 0.38)
  Top 0.2: v48.15,31.85 48.15,32.35 48.4,32.6 U$13.51
  Bottom 0.2: U$1.P$54 48.7,26.35 49.2,26.85 49.2,29.9 48.7,30.4 48.7,31.15 48.15,31.7 v48.15,31.85
EMI_D9  (via drill 0.38)
  Top 0.2: v47.85,30.9 48.4,30.9 48.8,31.3 U$13.52
  Bottom 0.2: U$1.P$56 47.4,25.9 47.7,26.2 48,26.2 48.8,27 48.8,29.7 47.85,30.65 v47.85,30.9
EMI_D10  (via drill 0.38)
  Top 0.2: U$13.54 49.6,30.4 49.2,30 v45.15,30
  Bottom 0.2: v45.15,30 47.9,30 48.4,29.5 48.4,27.15 47.85,26.6 47.25,26.6 46.75,26.1 U$1.P$57
EMI_D11  (via drill 0.38)
  Top 0.2: U$13.55 50,30.2 49.4,29.6 46.1,29.6 v45.85,29.35
  Bottom 0.2: v45.85,29.35 46.1,29.6 47.7,29.6 48,29.3 48,27.3 47.7,27 47.05,27 46.25,26.2 45.85,26.2 45.45,25.8 U$1.P$59 45.45,25.45
EMI_D12  (via drill 0.38)
  Top 0.2: v45.85,28.05 46.2,28.05 46.75,28.6 50.55,28.6 50.8,28.85 U$13.57
  Bottom 0.2: U$1.P$60 44.8,25.85 45.85,26.9 v45.85,28.05
EMI_D13  (via drill 0.38)
  Top 0.2: v45.15,27.4 46.15,27.4 46.95,28.2 50.75,28.2 51.2,28.65 U$13.58
  Bottom 0.2: U$1.P$62 43.5,25.75 43.85,26.1 44.5,26.1 45.15,26.75 v45.15,27.4
EMI_D14  (via drill 0.38)
  Top 0.2: v42.85,26.1 46.05,26.1 47.35,27.4 51.15,27.4 52,28.25 U$13.60
  Bottom 0.2: U$1.P$63 v42.85,26.1
EMI_D15  (via drill 0.38)
  Top 0.2: v43.55,26.75 46.1,26.75 47.15,27.8 50.95,27.8 51.6,28.45 U$13.59
  Bottom 0.2: U$1.P$65 41.55,26.15 42.15,26.75 v43.55,26.75
EMI_DQM0  (via drill 0.38)
  Top 0.2: U$13.46 46.4,32.1 v46.45,32.05
  Bottom 0.2: U$1.P$20 53.25,36.15 52.45,35.35 49.8,35.35 49.1,34.65 48.05,34.65 46.45,33.05 | 46.45,33.05 46.4,33 | v46.45,32.05 46.45,33.05
EMI_DQM1  (via drill 0.38)
  Top 0.2: U$13.56 50.4,29.95 50.05,29.6 v50.05,29.25
  Bottom 0.2: U$1.P$47 53.25,26.7 52.95,27 51.35,27 50.05,28.3 v50.05,29.25
EMI_DQS0  (via drill 0.38)
  Top 0.2: U$13.39 43.6,34.1 43.45,34.25 42.85,34.25 v42.4,34.7
  Bottom 0.2: v42.4,34.7 42.85,34.25 46.85,34.25 47.65,35.05 48.95,35.05 49.4,35.5 49.4,35.8 49.55,35.95 50.4,35.95 50.65,36.2 U$1.P$16
EMI_DQS1  (via drill 0.38)
  Top 0.2: v50.05,26.75 47.3,26.75 46.25,25.7 43.45,25.7 43.2,25.45 42.5,25.45 42.15,25.8 42.15,26.4 43.52,27.77 43.52,30.77 43.75,31 43.75,31.75 44,32 U$13.40
  Bottom 0.2: U$1.P$51 50.65,26.15 v50.05,26.75
EMI_GND  (7 unrouted)
GND  (via drill 0.38)  (83 unrouted)
  Route2 0.2: v46.1,22.6 46.3,22.6 | v52.6,26.2 52.4,26.2 | v49.35,26.05 49.3,26.3 | v48.05,39.45 48.05,39.8 | v44.15,39.45 44.15,39.8
  Bottom 0.2: v46.1,22.6 U$1.P$58 | 52.95,22.85 52.95,24.15 52.6,24.5 U$1.P$48 v52.6,26.2 | 52.95,22.85 53.05,22.75 53.35,22.75 R13.1 | C33.2 R7.1 52.3,21.9 52.95,21.9 | C31.2 52.95,21.9 | 52.95,21.9 52.95,22.85 | U$1.P$52 50,25.75 49.8,25.95 49.4,25.95 v49.35,26.05 | C39.2 48.05,37.95 U$1.P$12 47.95,36.9 48.05,37 v48.05,39.45 | C41.2 44.15,38.2 U$1.P$6 v44.15,39.45
  other vias: 47.1,22.6 55.2,21.05 61.65,23.5 59.15,21.2
  pour Bottom (no thermals): 45.65,19.7 45.65,22.25 45.5,22.4 45.5,24.1 47.65,24.1 47.65,22.15 47.2,21.7 47.2,19.7
  pour Route2: 50.7,22.35 50.7,21.65 50.65,21.6 50.65,22.35
  pour Bottom (no thermals): 52.35,19.6 52.35,21.2 52.05,21.5 50.75,21.5 50.6,21.65 50.6,22.35 50.7,22.45 52.6,22.45 52.85,22.7 52.85,22.9 53,23.05 54,23.05 54.1,22.95 54.1,19.6 53.9,19.4 52.45,19.4 52.35,19.5
  pour Bottom (no thermals): 53.9,19.4 54.75,20.25 60.5,20.25 62.2,21.95 62.2,26.05 61.35,26.05 61.3,26 61.3,24.2 54,24.2 53.9,24.1
GND1
  Route2 0.2: 42.45,47.95 47.6,47.95
HOST1_D+  (1 unrouted)
HOST1_D+_UNFILTERED1  (2 unrouted)
HOST1_D-  (1 unrouted)
HOST1_D-_UNFILTERED1  (2 unrouted)
HOST2_D-_UNFILTERED1  (2 unrouted)
HOST_D+  (3 unrouted)
HOST_D-  (2 unrouted)
I2C_SCL  (1 unrouted)
I2C_SDA  (1 unrouted)
IMXUSB+  (1 unrouted)
IMXUSB-  (1 unrouted)
LCD_D0  (2 unrouted)
LCD_D1  (2 unrouted)
LCD_D2  (2 unrouted)
LCD_D3  (2 unrouted)
LCD_RS  (2 unrouted)
LRDAC1  (3 unrouted)
MIC  (1 unrouted)
N$1  (2 unrouted)
N$2  (1 unrouted)
N$3  (1 unrouted)
N$4  (1 unrouted)
N$5  (1 unrouted)
N$7  (1 unrouted)
N$8
  Bottom 0.2: U$1.P$49 51.95,23.55 R7.2 C33.1 50.75,23.65 R6.1 C32.2
  pour Bottom (no thermals): 49.15,20.05 49.15,24.25 49.2,24.3 51.7,24.3 51.75,24.35 51.75,25.55 52.15,25.55 52.15,24.35 52.2,24.3 52.6,24.3 52.75,24.15 52.75,22.75 52.65,22.65 50.45,22.65 50.3,22.5 50.3,20.05
  pour Bottom (no thermals): 51.8,19.5 49.35,19.5 49.15,19.7 49.15,21.55 50.25,21.55 50.65,21.15 51.55,21.15 51.8,20.9
N$9  (1 unrouted)
N$13  (1 unrouted)
N$14  (2 unrouted)
N$18  (1 unrouted)
N$26  (2 unrouted)
N$27  (1 unrouted)
N$28  (1 unrouted)
N$30  (2 unrouted)
N$31  (1 unrouted)
N$32  (1 unrouted)
N$33  (1 unrouted)
N$34  (1 unrouted)
N$35  (2 unrouted)
N$36  (2 unrouted)
N$37  (2 unrouted)
N$39  (3 unrouted)
N$40  (3 unrouted)
N$41  (1 unrouted)
N$43  (1 unrouted)
RTS_HV  (2 unrouted)
RX_HV  (2 unrouted)
TPS_VBUS  (1 unrouted)
TX_HV  (2 unrouted)
USB_EN  (1 unrouted)
USB_HUB_RESET  (1 unrouted)
USB_HUB_SUSPEND  (1 unrouted)
USB_MASTER_POWER  (1 unrouted)
USB_SEL  (1 unrouted)
USBPWR_1  (2 unrouted)
USBPWR_2  (1 unrouted)
VBUS_SENSE  (2 unrouted)
VDD5V  (2 unrouted)
VDD_4P2  (1 unrouted)
VDD_BAT  (1 unrouted)
VDD_XTAL  (3 unrouted)
VDDA  (2 unrouted)
VDDD  (3 unrouted)
VDDIO_3V3  (22 unrouted)
VDDM_2V5  (via drill 0.38)  (23 unrouted)
  Top 0.2: U$13.38 43.2,32.5 v43.35,32.4 | U$13.45 46,32.85 v45.55,32.4
  Route2 0.2: v50,39.4 49.95,39.45 49.95,39.6
  Route15 0.2: v44.15,22.6 44.15,22.65 44.2,22.65 | v46.1,39.45 46.1,39.65 | v42.2,38.3 42.2,38.9 | v43.35,32.4 43.4,32.1 | v45.55,32.4 45.55,32.2
  Bottom 0.2: v44.15,22.6 44.15,23.6 | 44.15,23.6 44.15,23.65 | 44.15,23.65 U$1.P$61 | 44.15,23.6 44.55,23.6 C42.1 44.15,23.65 | C39.1 50,38 U$1.P$15 v50,39.4 | C41.1 46.1,38.05 U$1.P$9 v46.1,39.45 | U$1.P$3 v42.2,38.3 41.15,38.3 40.9,38.05 U$1.P$1
  pour Bottom (no thermals): 47.85,25.5 47.85,21.95 47.45,21.55 47.45,19.75 47.75,19.45 48.65,19.45 48.95,19.75 48.95,24.25 48.9,24.3 48.45,24.3 48.25,24.5 48.25,25.5
  pour Bottom (no thermals): 47.8,19.45 43.1,19.45 42.85,19.7 42.85,23.9 43.15,24.2 43.7,24.2 43.95,24.45 43.95,25.55 44.35,25.55 44.35,24.45 44.6,24.2 45.1,24.2 45.25,24.05 45.25,19.85 45.55,19.55 47.3,19.55 47.4,19.65 47.4,21.5 47.45,21.55
  pour Bottom (no thermals): 42.85,22 42.85,19 43.1,18.75 48.7,18.75 48.95,19 48.95,19.95 47.95,19.95 47.45,19.45 44.7,19.5 44.7,22